# Altium schematic sheet gwcard.SchDoc
size A0
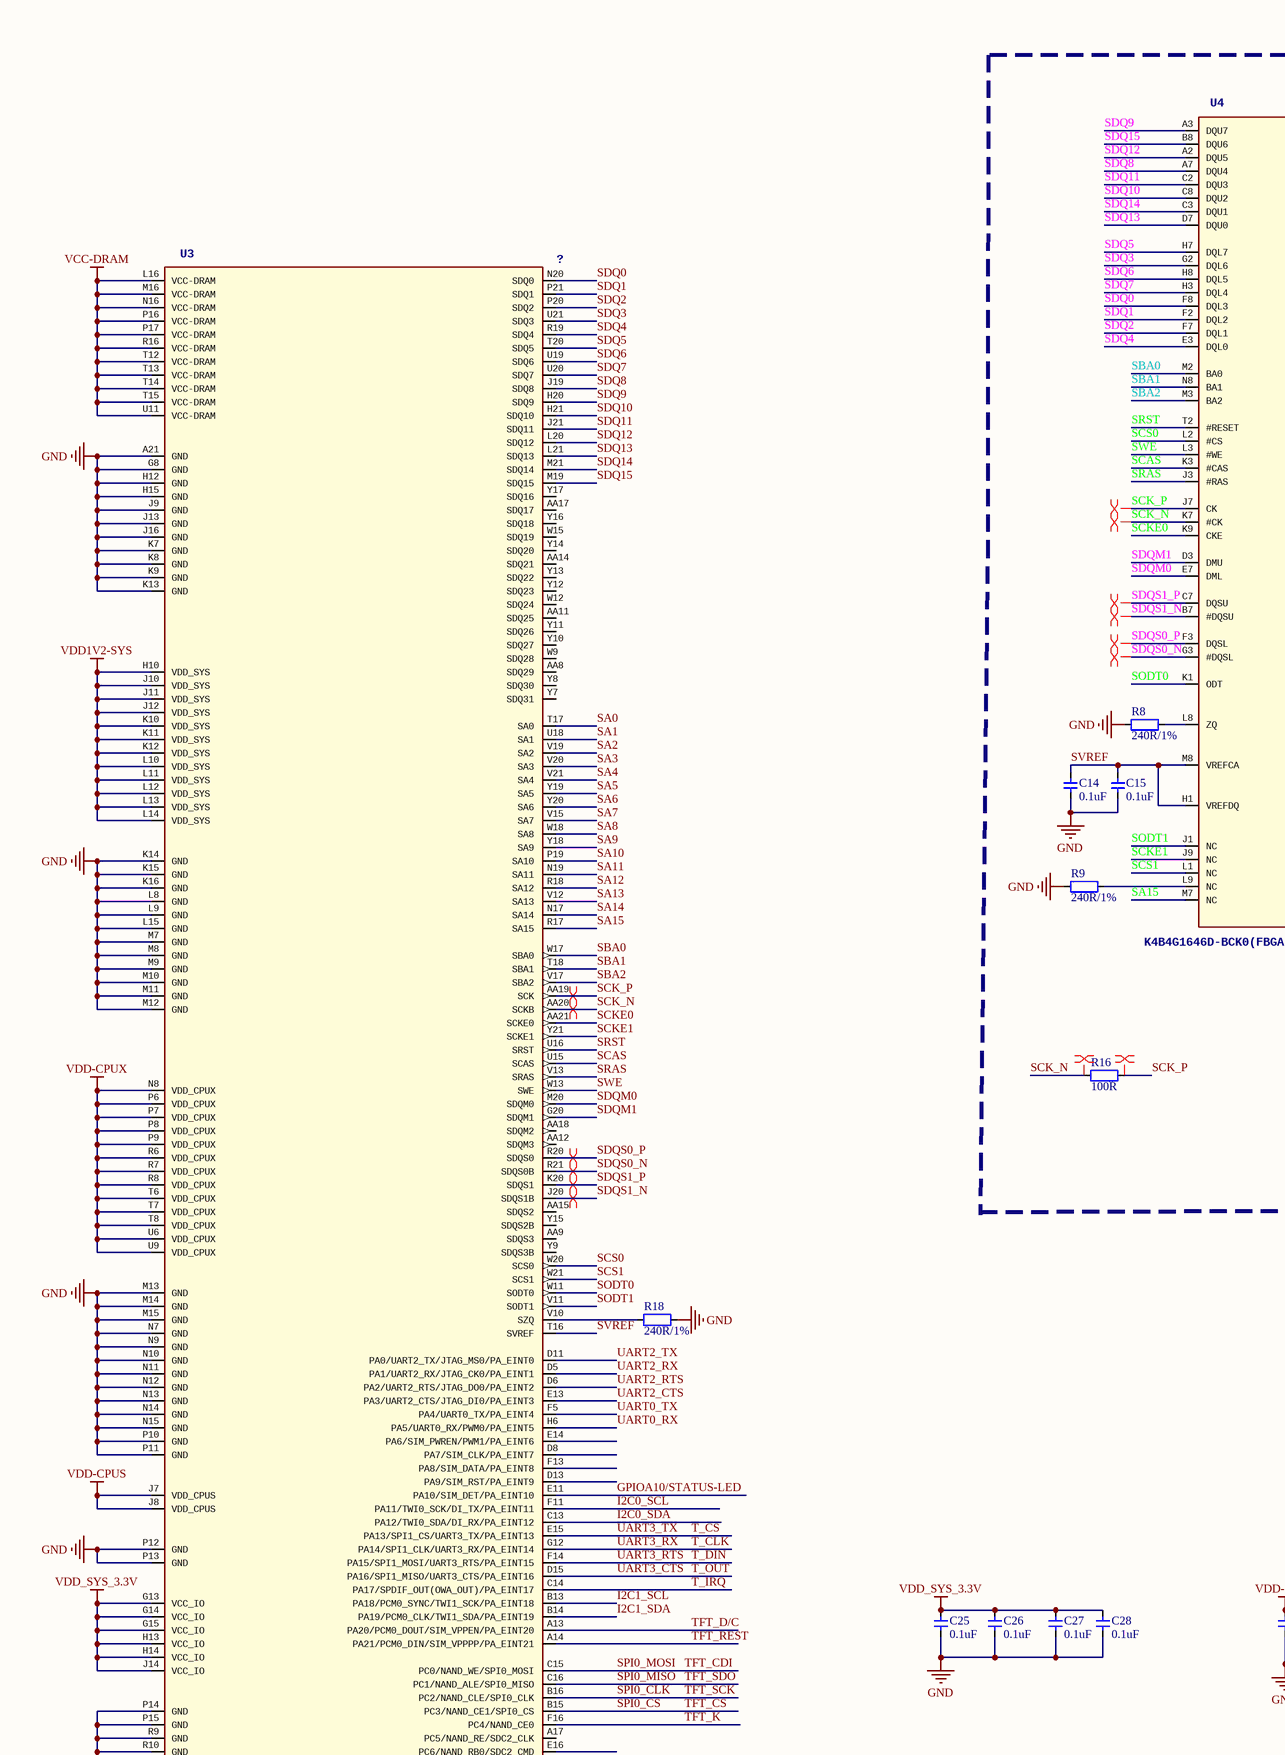
[diagram p0: gwcard.SchDoc, top left]
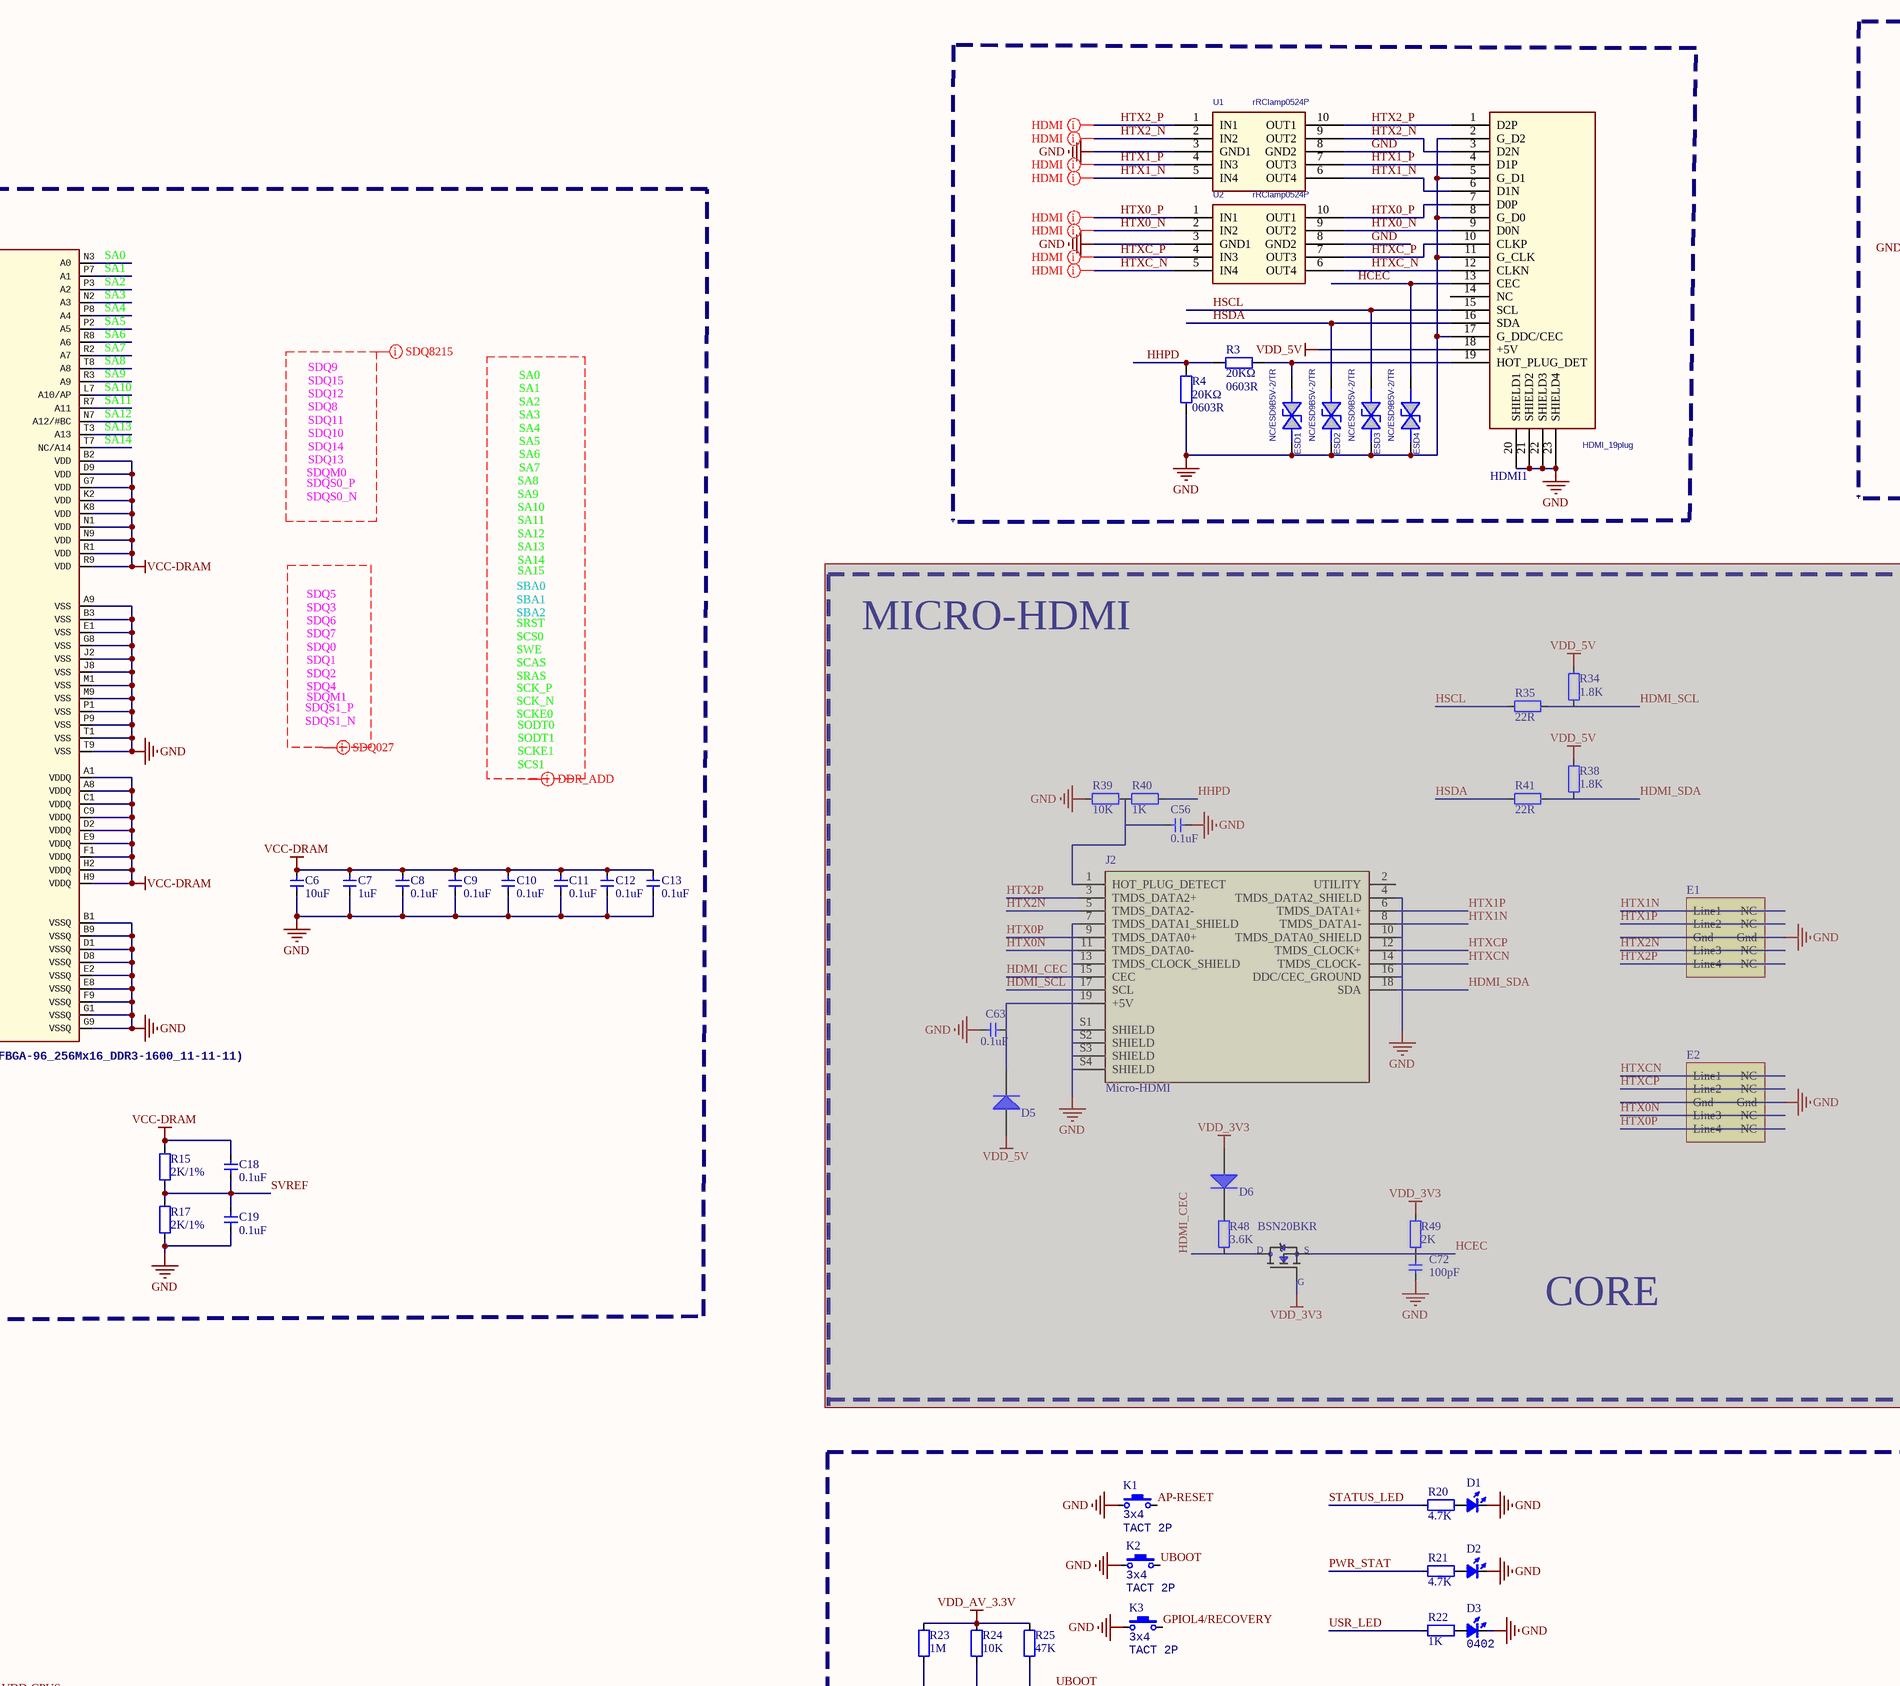
[diagram p1: gwcard.SchDoc, top middle]
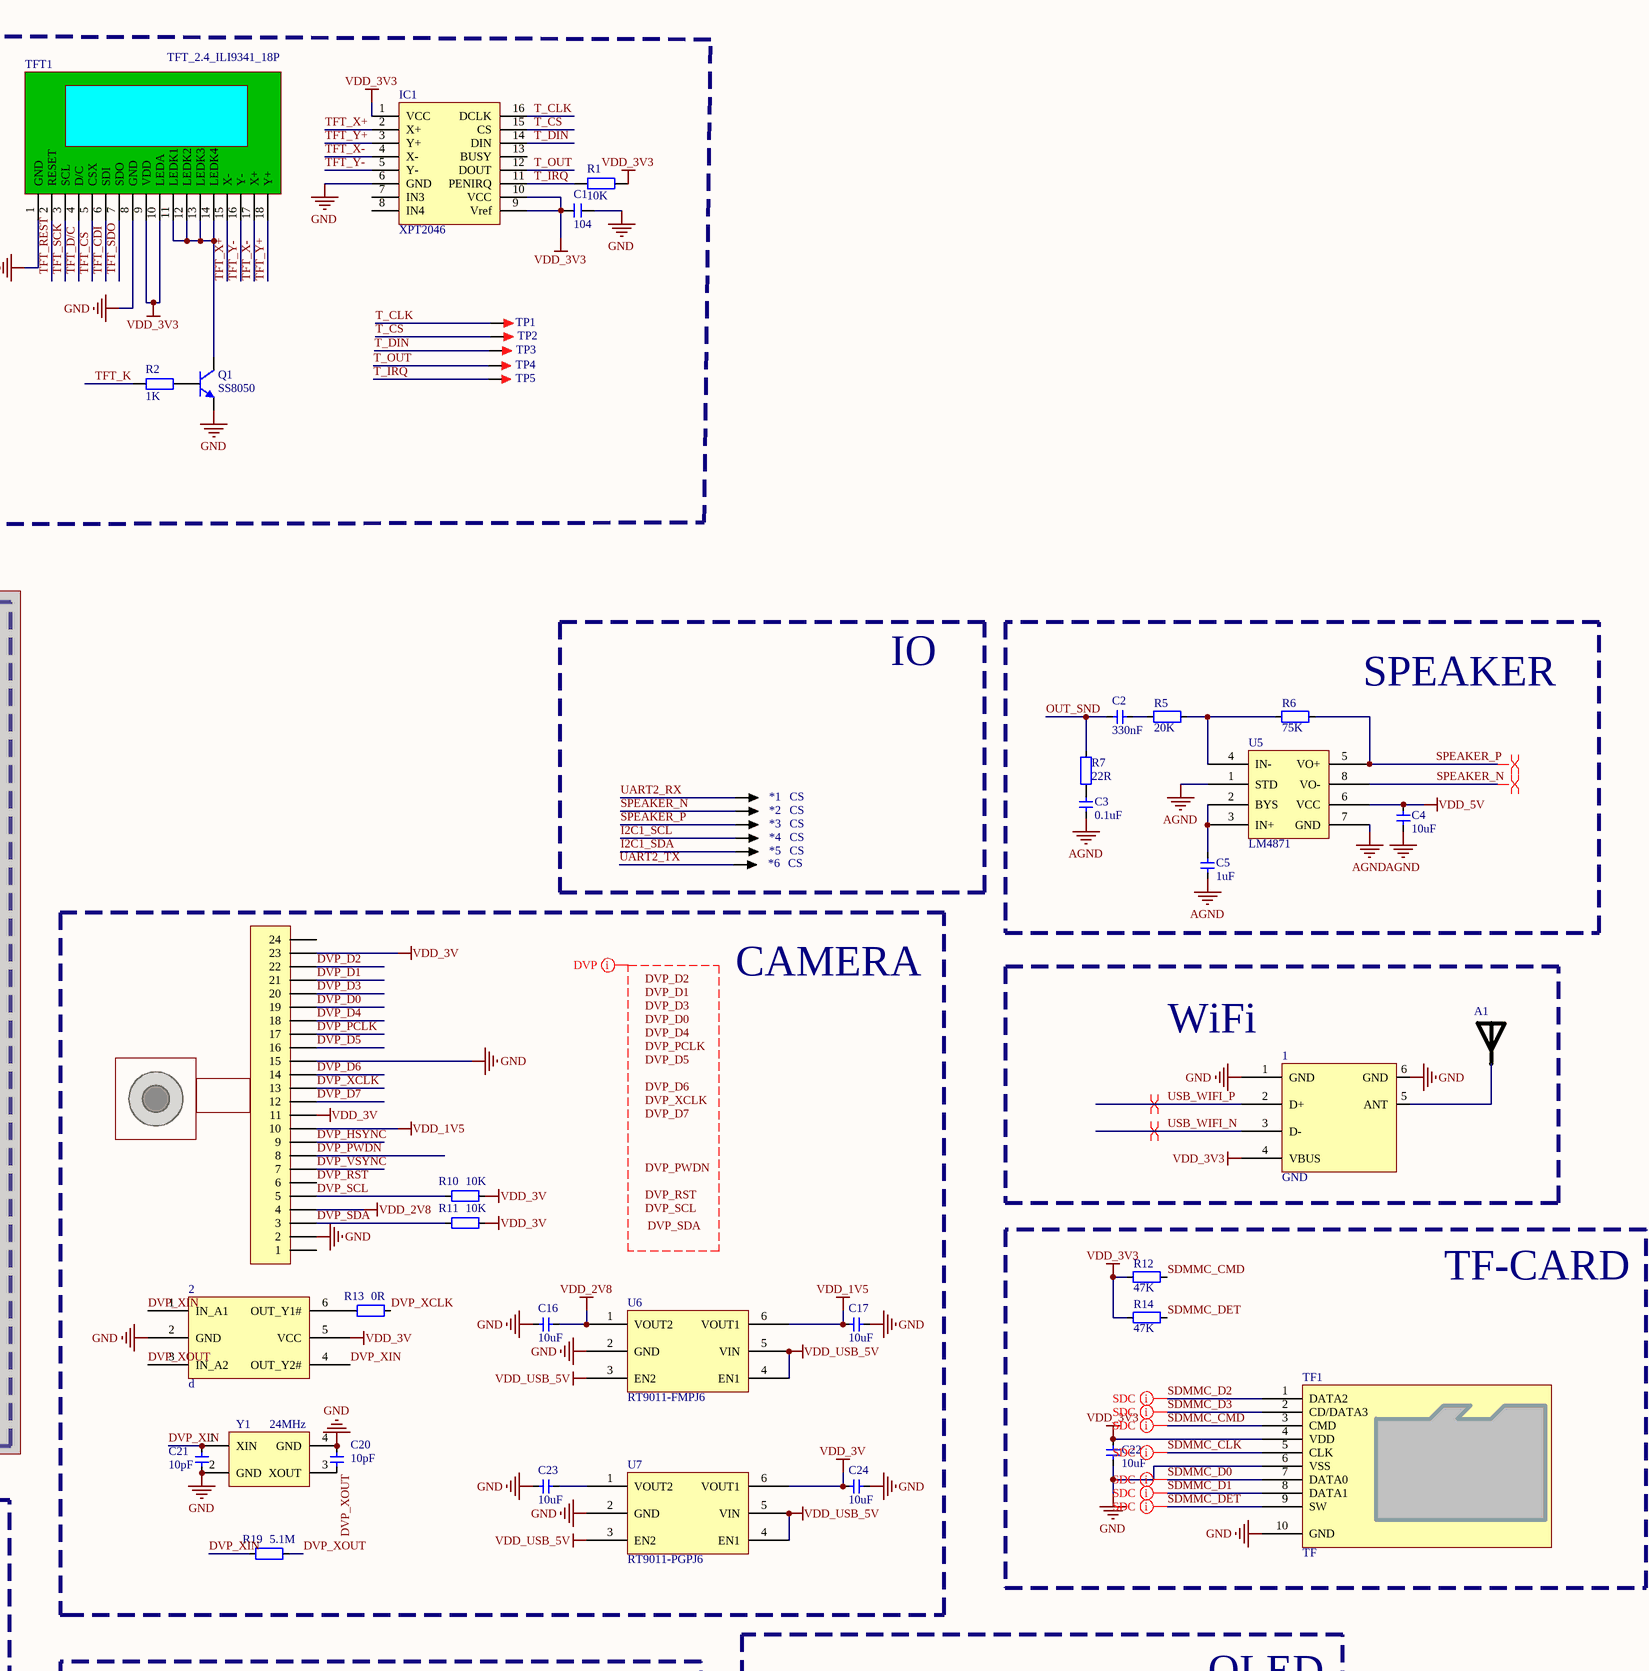
[diagram p2: gwcard.SchDoc, top right]
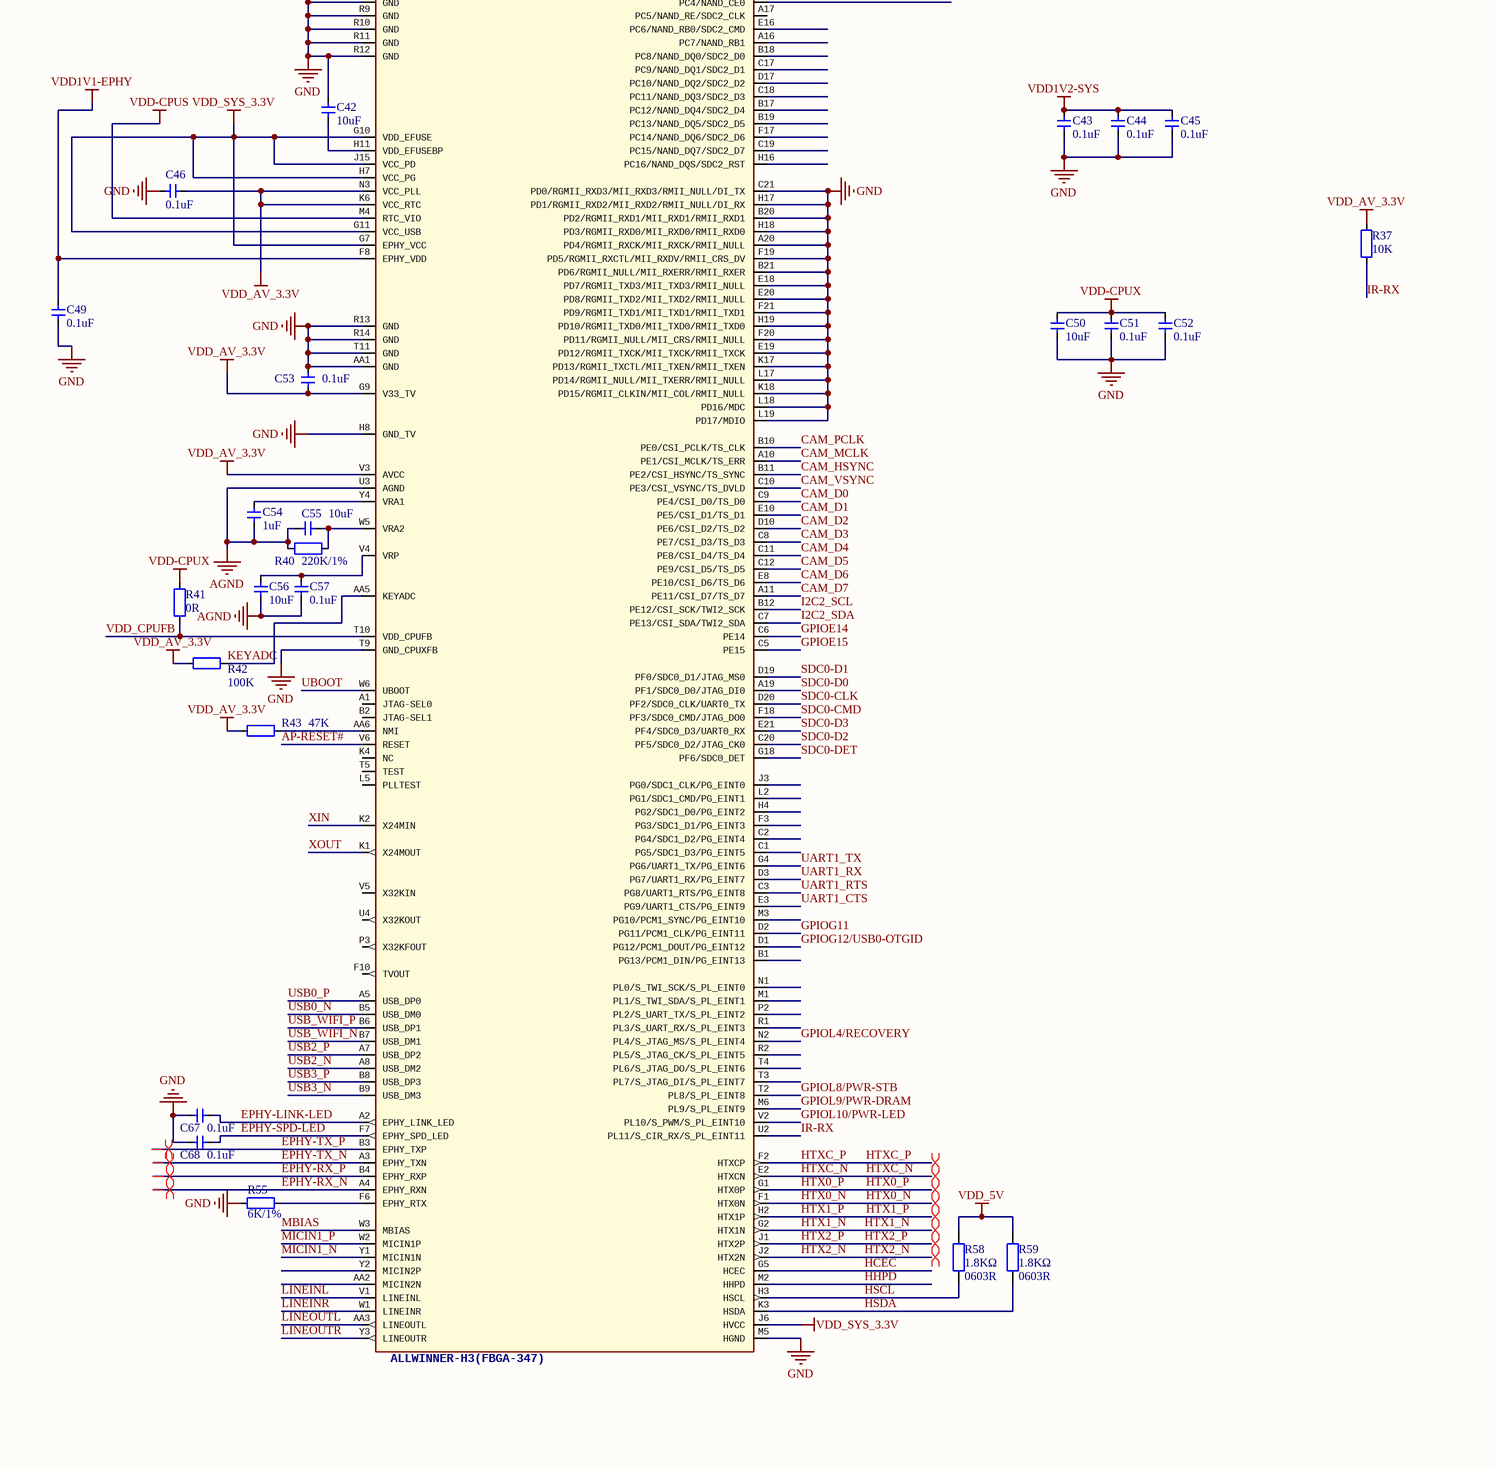
[diagram p3: gwcard.SchDoc, bottom left]
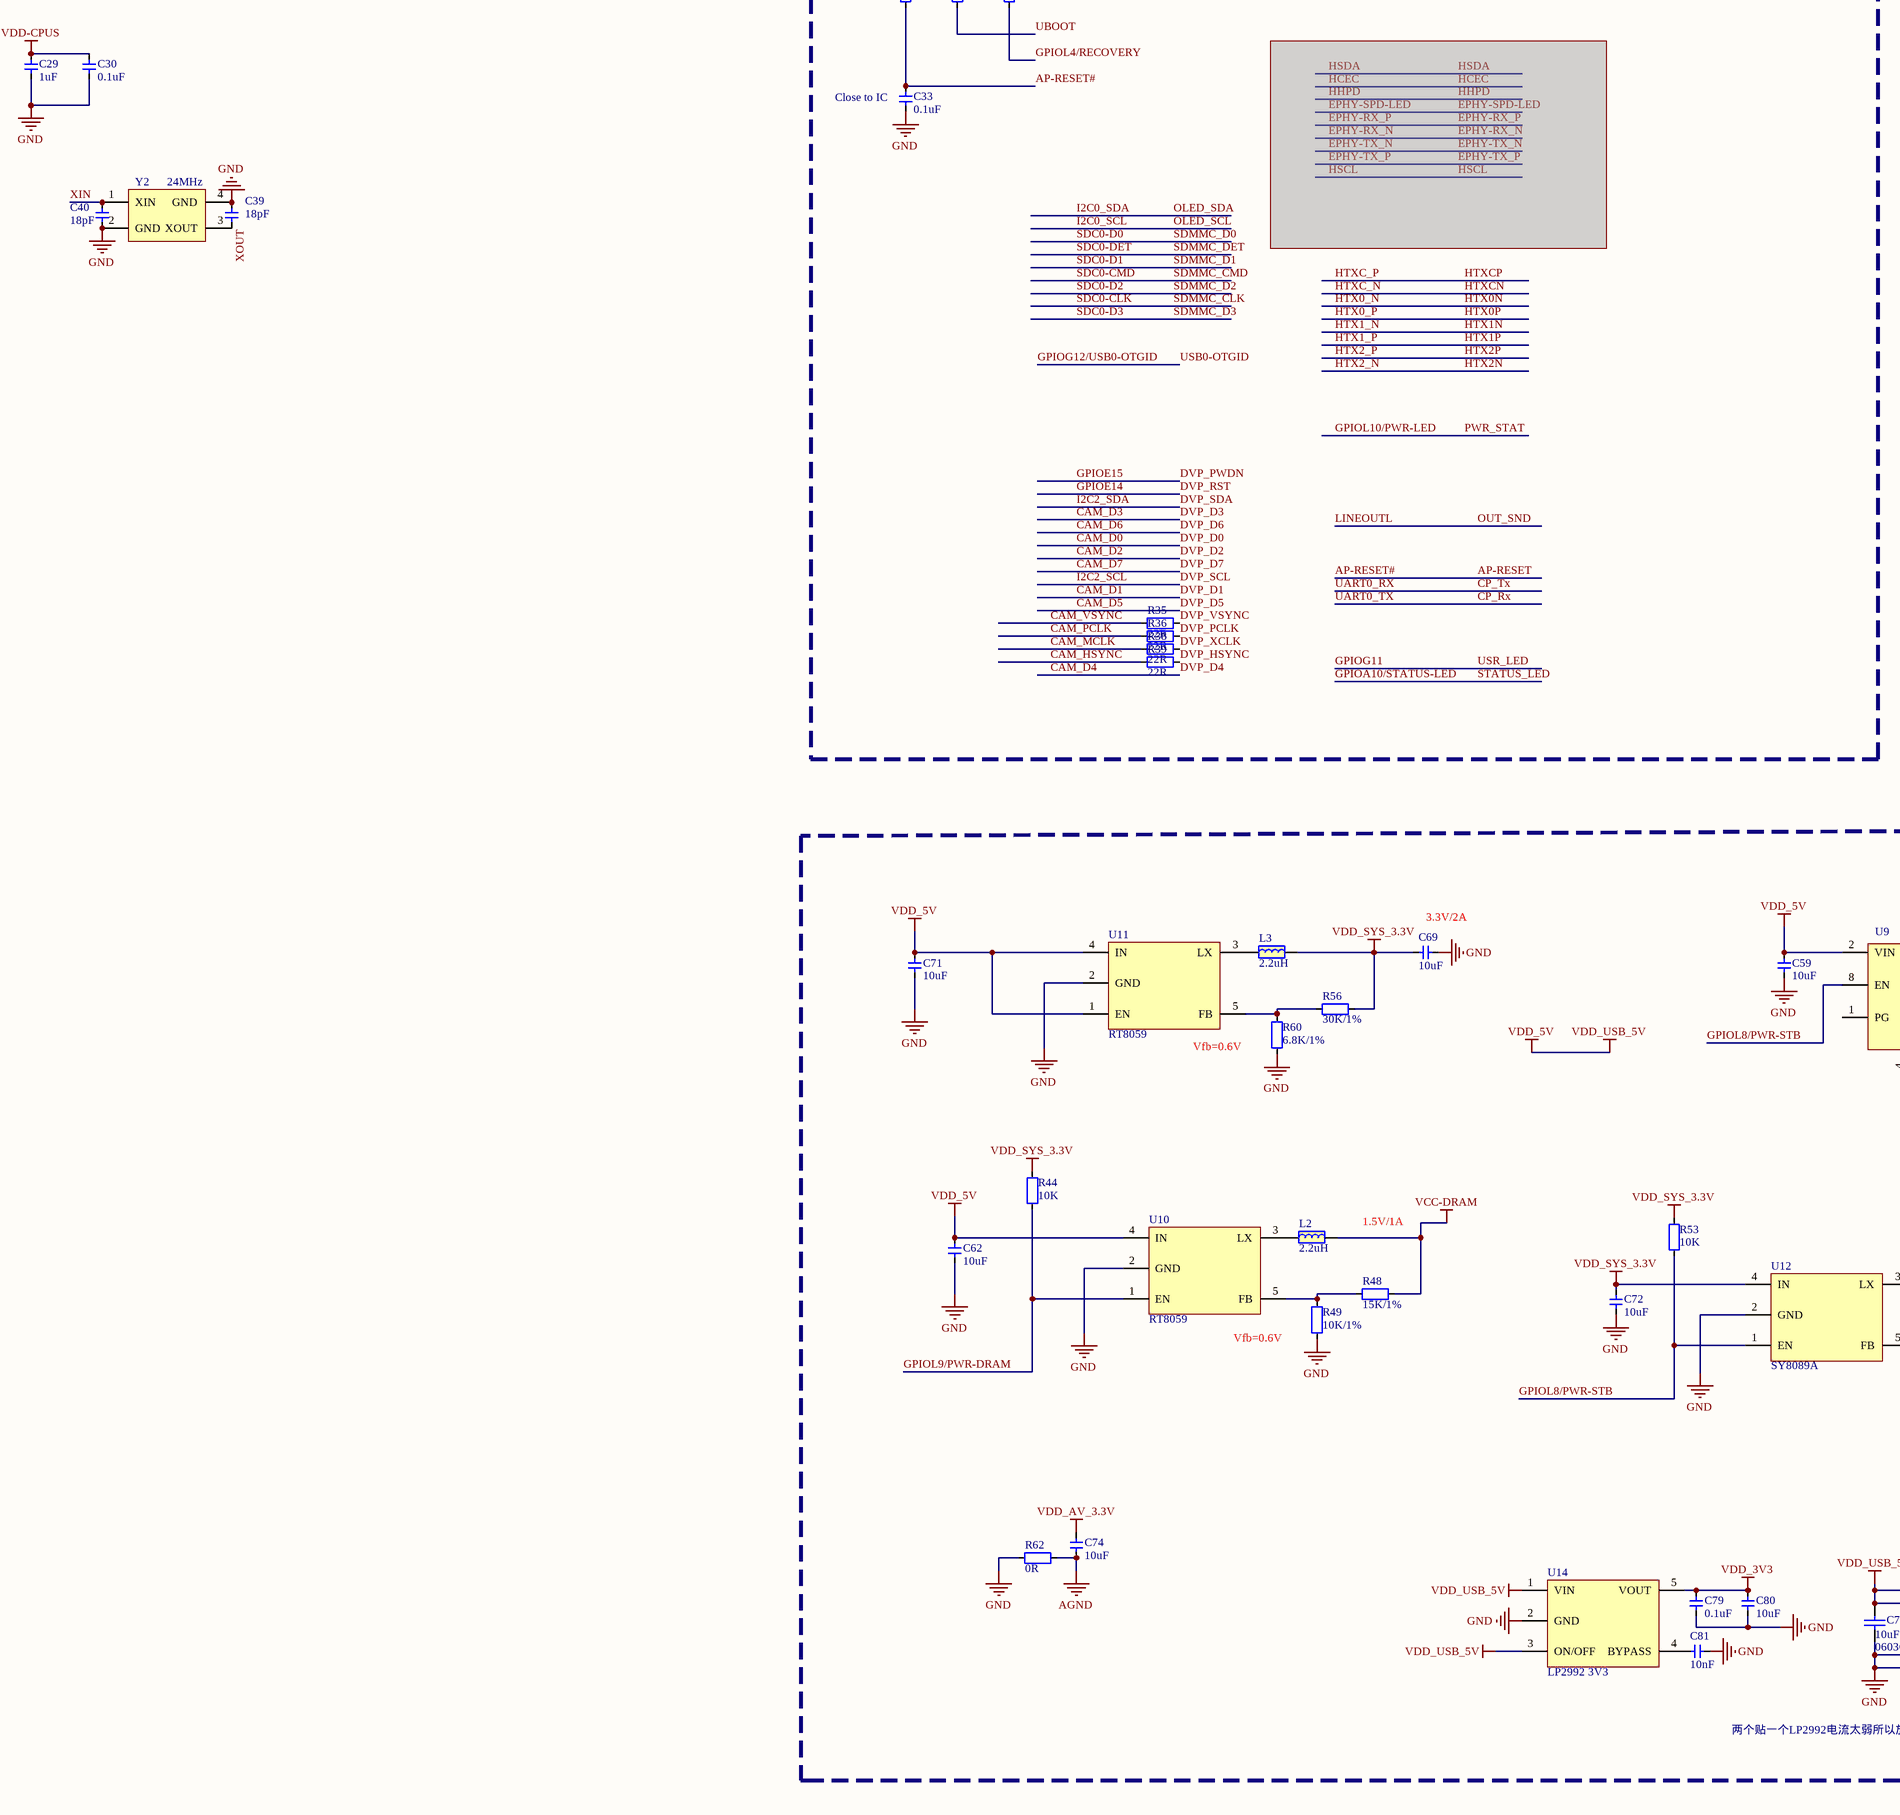
[diagram p4: gwcard.SchDoc, bottom middle]
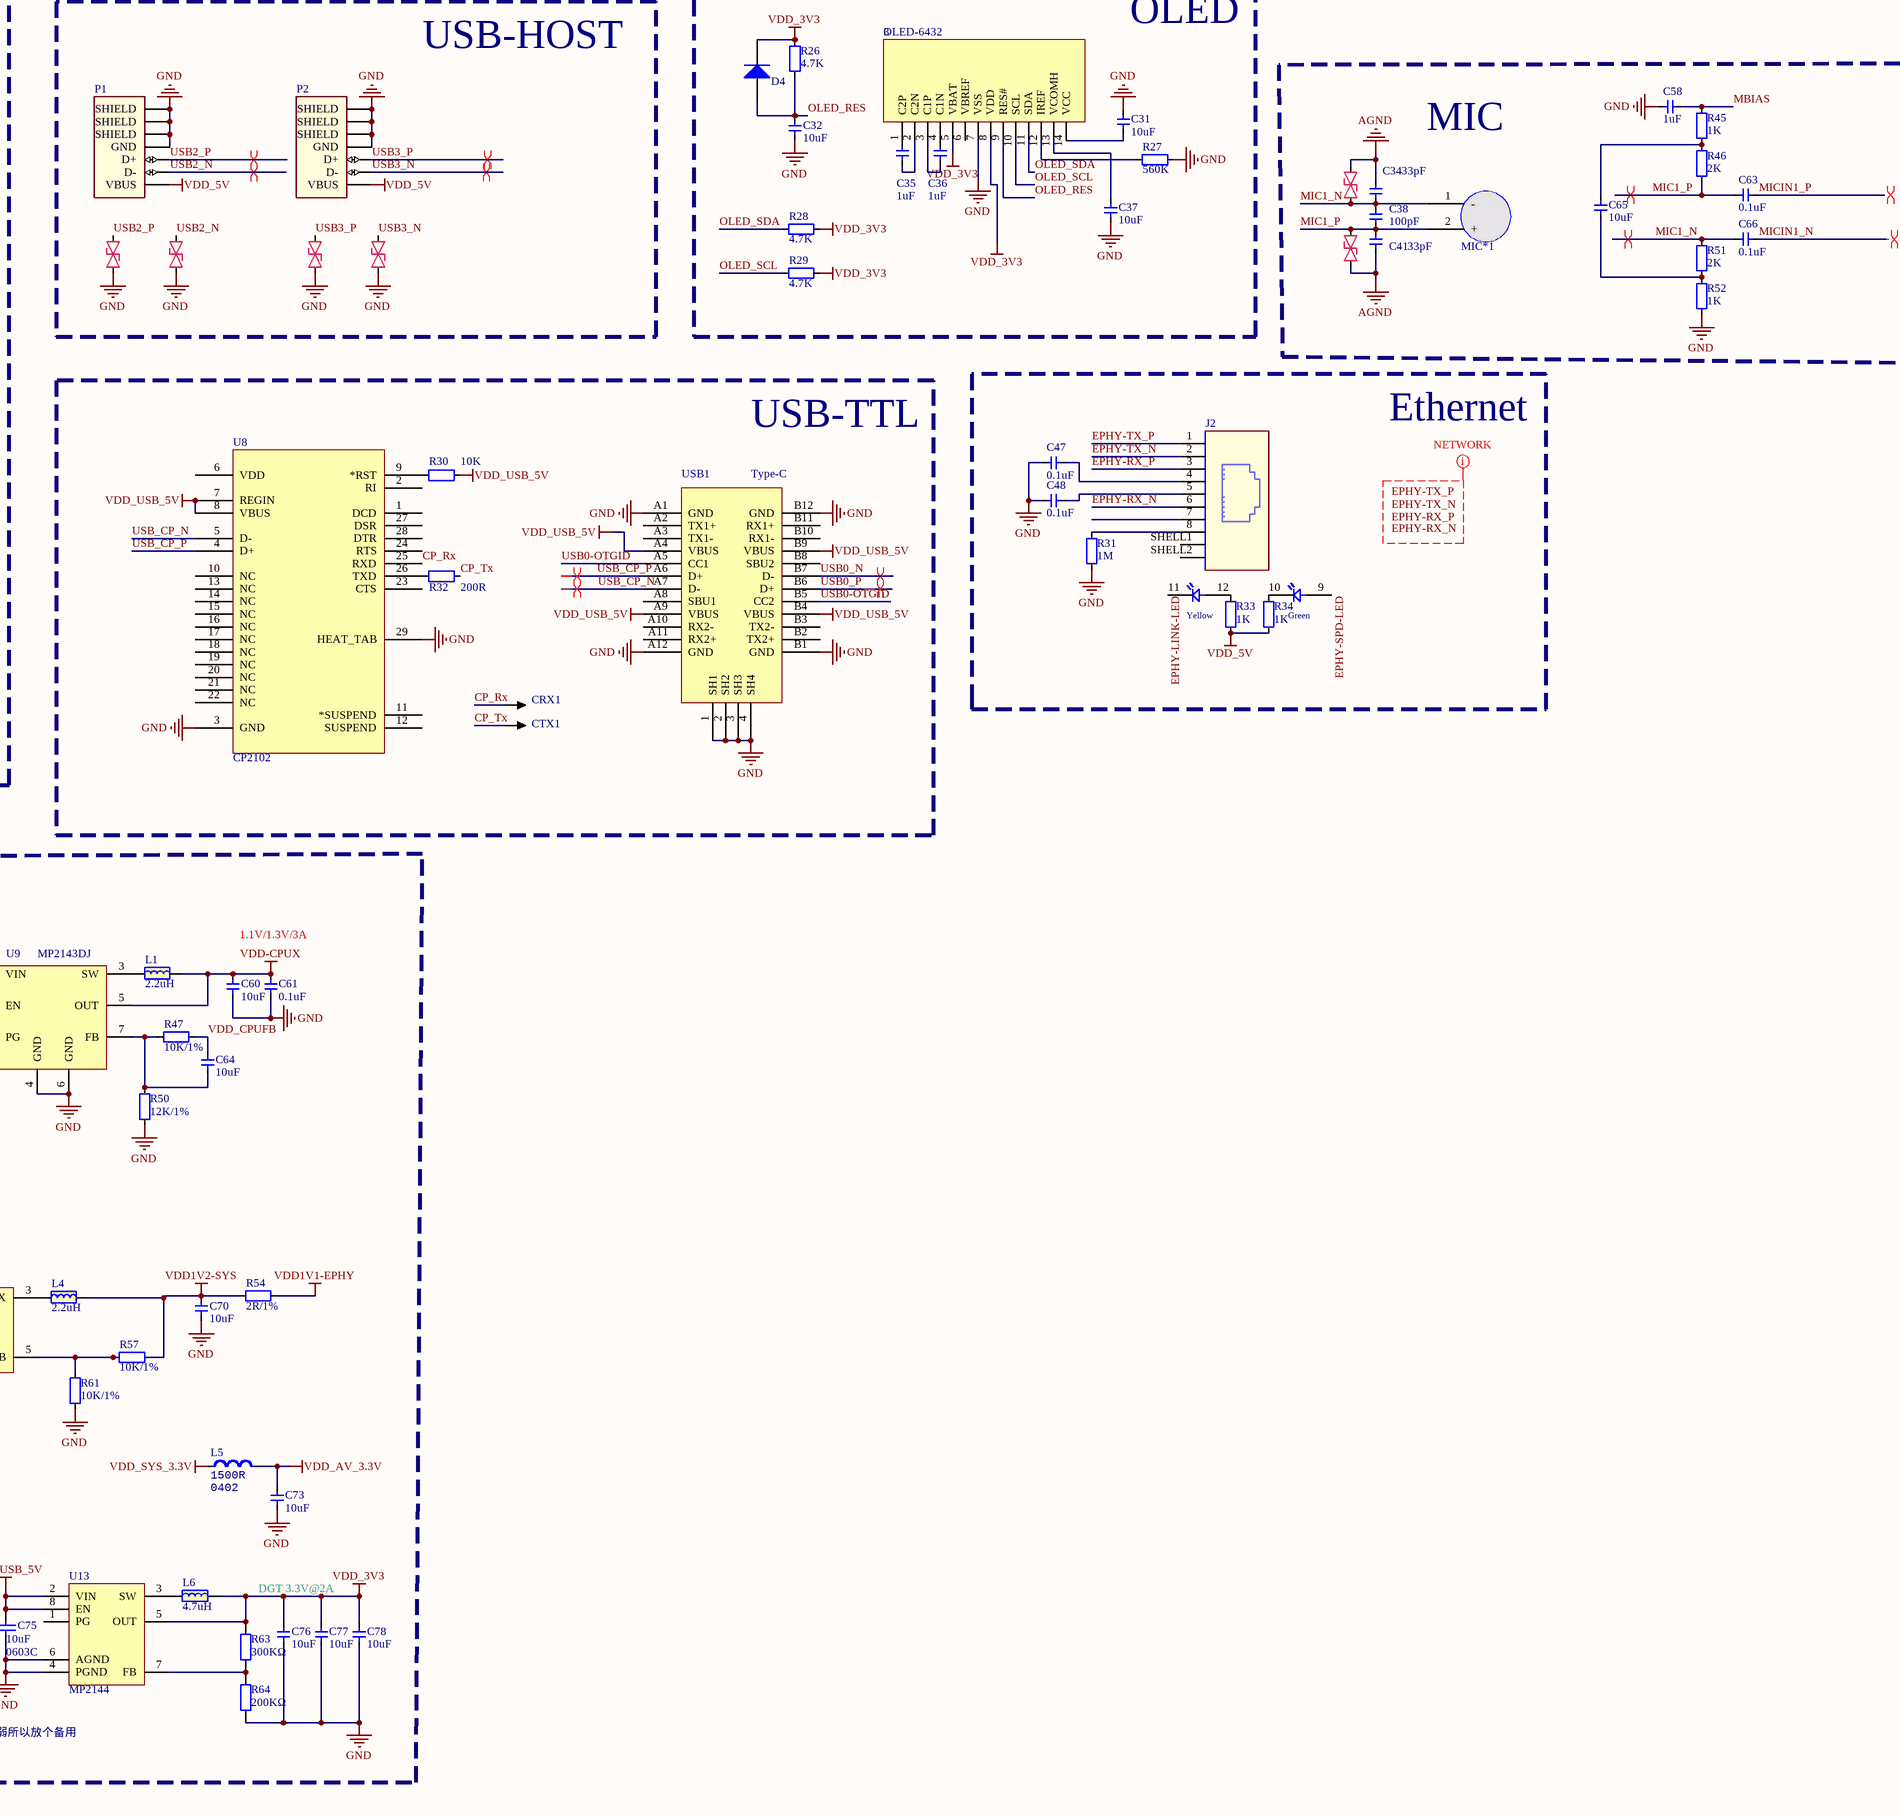
[diagram p5: gwcard.SchDoc, bottom right]

## Parts
(Parts that share a designator on the sheet are numbered #1, #2 ... from top to bottom, then left to right.)
1  GND  [USB-WIFI-ANT]
2  d  [SOT363-6]
3  OLED-6432  [OLED-6432-TOP]
4  BSN20BKR  [SOT23-3]  (masked out: inside a compile mask, not in the netlist)
*1  CS  [TEST 1.6]
*2  CS  [TEST 1.6]
*3  CS  [TEST 1.6]
*4  CS  [TEST 1.6]
*5  CS  [TEST 1.6]
*6  CS  [TEST 1.6]
A1  RAINSUN  [ANT-RAINSUN-AN5120]  (value not drawn)
C1  104  [CAP_0402]
C2  330nF  [CAP_0402]
C3  0.1uF  [CAP_0402]
C4  10uF  [CAP_0402]
C5  1uF  [CAP_0402]
C6  10uF  [CAP_0402]
C7  1uF  [CAP_0402]
C8  0.1uF  [CAP_0402]
C9  0.1uF  [CAP_0402]
C10  0.1uF  [CAP_0402]
C11  0.1uF  [CAP_0402]
C12  0.1uF  [CAP_0402]
C13  0.1uF  [CAP_0402]
C14  0.1uF  [CAP_0402]
C15  0.1uF  [CAP_0402]
C16  10uF  [CAP_0402]
C17  10uF  [CAP_0402]
C18  0.1uF  [CAP_0402]
C19  0.1uF  [CAP_0402]
C20  10pF  [CAP_0402]
C21  10pF  [CAP_0402]
C22  10uF  [CAP_0402]
C23  10uF  [CAP_0402]
C24  10uF  [CAP_0402]
C25  0.1uF  [CAP_0402]
C26  0.1uF  [CAP_0402]
C27  0.1uF  [CAP_0402]
C28  0.1uF  [CAP_0402]
C29  1uF  [CAP_0402]
C30  0.1uF  [CAP_0402]
C31  10uF  [CAP_0402]
C32  10uF  [CAP_0402]
C33  0.1uF  [CAP_0402]
C34  33pF  [CAP_0402]
C35  1uF  [CAP_0402]
C36  1uF  [CAP_0402]
C37  10uF  [CAP_0402]
C38  100pF  [CAP_0402]
C39  18pF  [CAP_0402]
C40  18pF  [CAP_0402]
C41  33pF  [CAP_0402]
C42  10uF  [CAP_0402]
C43  0.1uF  [CAP_0402]
C44  0.1uF  [CAP_0402]
C45  0.1uF  [CAP_0402]
C46  0.1uF  [CAP_0402]
C47  0.1uF  [CAP_0402]
C48  0.1uF  [CAP_0402]
C49  0.1uF  [CAP_0402]
C50  10uF  [CAP_0402]
C51  0.1uF  [CAP_0402]
C52  0.1uF  [CAP_0402]
C53  0.1uF  [CAP_0402]
C54  1uF  [CAP_0402]
C55  10uF  [CAP_0402]
C56#1  0.1uF  [CAP_0402]  (masked out: inside a compile mask, not in the netlist)
C56#2  10uF  [CAP_0402]
C57  0.1uF  [CAP_0402]
C58  1uF  [CAP_0402]
C59  10uF  [CAP_0402]
C60  10uF  [CAP_0402]
C61  0.1uF  [CAP_0402]
C62  10uF  [CAP_0402]
C63#1  0.1uF  [CAP_0402]  (masked out: inside a compile mask, not in the netlist)
C63#2  0.1uF  [CAP_0402]
C64  10uF  [CAP_0402]
C65  10uF  [CAP_0402]
C66  0.1uF  [CAP_0402]
C67  0.1uF  [CAP_0402]
C68  0.1uF  [CAP_0402]
C69  10uF  [CAP_0402]
C70  10uF  [CAP_0402]
C71  10uF  [CAP_0402]
C72#1  100pF  [CAP_0402]  (masked out: inside a compile mask, not in the netlist)
C72#2  10uF  [CAP_0402]
C73  10uF  [CAP_0402]
C74  10uF  [CAP_0402]
C75  10uF  Package: 0603C  [CAP_0402]
C76  10uF  [CAP_0402]
C77  10uF  [CAP_0402]
C78  10uF  [CAP_0402]
C79  0.1uF  [CAP_0402]
C80  10uF  [CAP_0402]
C81  10nF  [CAP_0402]
CRX1  CS  [TEST 1.6]  (value not drawn)
CTX1  CS  [TEST 1.6]  (value not drawn)
D1  color?  [LED_0402_RED]  (value not drawn)
D2  color?  [LED_0402_RED]  (value not drawn)
D3  Type: 0402  [LED_0402_RED]  (hidden comment: color?)
D4  二极管-5B5817WS  [SOD-323]  (value not drawn)
D5  二极管-5B5817WS  [SOD-323]  (value not drawn)  (masked out: inside a compile mask, not in the netlist)
D6  二极管-5B5817WS  [SOD-323]  (value not drawn)  (masked out: inside a compile mask, not in the netlist)
E1  E?  [DFN-2510]  (value not drawn)  (masked out: inside a compile mask, not in the netlist)
E2  E?  [DFN-2510]  (value not drawn)  (masked out: inside a compile mask, not in the netlist)
ESD1  NC/ESD9B5V-2/TR  [tvs0402]
ESD2  NC/ESD9B5V-2/TR  [tvs0402]
ESD3  NC/ESD9B5V-2/TR  [tvs0402]
ESD4  NC/ESD9B5V-2/TR  [tvs0402]
ESD-1  ESD-0402  [ESD-0402]  (value not drawn)
ESD-2  ESD-0402  [ESD-0402]  (value not drawn)
ESD-3  ESD-0402  [ESD-0402]  (value not drawn)
ESD-4  ESD-0402  [ESD-0402]  (value not drawn)
ESD-5  ESD-0402  [ESD-0402]  (value not drawn)
ESD-6  ESD-0402  [ESD-0402]  (value not drawn)
HDMI1  HDMI_19plug  [HDMI_SMD_A]
IC1  XPT2046  [QFN16 4x4_N]
J1  0.5S_A_24PWB  [FPC-24P]  (value not drawn)
J2#1  Micro-HDMI  [MICRO HDMI]  (masked out: inside a compile mask, not in the netlist)
J2#2  RJ45座  [RJ45母座]  (value not drawn)
K1  value 3x4  [ButtonTACT_3x4x2_180]  (hidden comment: TACT 2P)
K2  value 3x4  [ButtonTACT_3x4x2_180]  (hidden comment: TACT 2P)
K3  value 3x4  [ButtonTACT_3x4x2_180]  (hidden comment: TACT 2P)
L1  2.2uH  [2520-L]
L2  2.2uH  [2520-L]
L3  2.2uH  [2520-L]
L4  2.2uH  [2520-L]
L5  value 1500R  Type: 0402  [IND_0402]  (hidden comment: H0402)
L6  4.7uH  [2520-L]
MIC*1  MIC*  [MIC-0416]  (value not drawn)
P1  USB-侧立式  [USB-侧立式]  (value not drawn)
P2  USB-侧立式  [USB-侧立式]  (value not drawn)
Q1  SS8050  [SOT23-3N]
R1  10K  [R 0402_M]
R2  1K  [R 0402_M]
R3  20KΩ  Package: 0603R  [RES_0402]
R4  20KΩ  Package: 0603R  [RES_0402]
R5  20K  [RES_0402]
R6  75K  [RES_0402]
R7  22R  [RES_0402]
R8  240R/1%  [RES_0402]
R9  240R/1%  [RES_0402]
R10  10K  [RES_0402]
R11  10K  [RES_0402]
R12  47K  [RES_0402]
R13  0R  [RES_0402]
R14  47K  [RES_0402]
R15  2K/1%  [RES_0402]
R16  100R  [RES_0402]
R17  2K/1%  [RES_0402]
R18  240R/1%  [RES_0402]
R19  5.1M  [RES_0402]
R20  4.7K  [RES_0402]
R21  4.7K  [RES_0402]
R22  1K  [RES_0402]
R23  1M  [RES_0402]
R24  10K  [RES_0402]
R25  47K  [RES_0402]
R26  4.7K  [RES_0402]
R27  560K  [RES_0402]
R28  4.7K  [RES_0402]
R29  4.7K  [RES_0402]
R30  10K  [RES_0402]
R31  1M  [RES_0402]
R32  200R  [RES_0402]
R33  1K  [RES_0402]
R34#1  1.8K  [RES_0402]  (masked out: inside a compile mask, not in the netlist)
R34#2  1K  [RES_0402]
R35#1  22R  [RES_0402]  (masked out: inside a compile mask, not in the netlist)
R35#2  22R  [RES_0402]
R36  22R  [RES_0402]
R37  10K  [RES_0402]
R38#1  1.8K  [RES_0402]  (masked out: inside a compile mask, not in the netlist)
R38#2  22R  [RES_0402]
R39#1  10K  [RES_0402]  (masked out: inside a compile mask, not in the netlist)
R39#2  22R  [RES_0402]
R40#1  1K  [RES_0402]  (masked out: inside a compile mask, not in the netlist)
R40#2  220K/1%  [RES_0402]
R41#1  22R  [RES_0402]  (masked out: inside a compile mask, not in the netlist)
R41#2  0R  [RES_0402]
R42  100K  [RES_0402]
R43  47K  [RES_0402]
R44  10K  [RES_0402]
R45  1K  [RES_0402]
R46  2K  [RES_0402]
R47  10K/1%  [RES_0402]
R48#1  3.6K  [RES_0402]  (masked out: inside a compile mask, not in the netlist)
R48#2  15K/1%  [RES_0402]
R49#1  2K  [RES_0402]  (masked out: inside a compile mask, not in the netlist)
R49#2  10K/1%  [RES_0402]
R50  12K/1%  [RES_0402]
R51  2K  [RES_0402]
R52  1K  [RES_0402]
R53  10K  [RES_0402]
R54  2R/1%  [RES_0402]
R55  6K/1%  [RES_0402]
R56  30K/1%  [RES_0402]
R57  10K/1%  [RES_0402]
R58  1.8KΩ  Package: 0603R  [RES_0402]
R59  1.8KΩ  Package: 0603R  [RES_0402]
R60  6.8K/1%  [RES_0402]
R61  10K/1%  [RES_0402]
R62  0R  [RES_0402]
R63  300KΩ  [RES_0402]
R64  200KΩ  [RES_0402]
TF1  TF  [TF-SOCKET - SHORT]
TFT1  TFT_2.4_ILI9341_18P  [FPC0.5 2H-WS-18P]
TP1  TEST  [TEST 1]  (value not drawn)
TP2  TEST  [TEST 1]  (value not drawn)
TP3  TEST  [TEST 1]  (value not drawn)
TP4  TEST  [TEST 1]  (value not drawn)
TP5  TEST  [TEST 1]  (value not drawn)
U1  rRClamp0524P  [RCLAMP0524P]
U2  rRClamp0524P  [RCLAMP0524P]
U3  ALLWINNER-H3(FBGA-347)  [FBGA-347 - duplicate]
U4  K4B4G1646D-BCK0(FBGA-96_256Mx16_DDR3-1600_11-11-11)  [FBGA96(HYNIX_SAMSUNG_512MX16_DDR3)]
U5  LM4871  [MSOP-8]
U6  RT9011-FMPJ6  [SOT23-6]
U7  RT9011-PGPJ6  [SOT23-6]
U8  CP2102  [QFN-28]
U9  MP2143DJ  [SOT23-8]
U10  RT8059  [SOT23-5]
U11  RT8059  [SOT23-5]
U12  SY8089A  [SOT23-5]
U13  MP2144  [SOT23-8]
U14  LP2992 3V3  [SOT23-5]
USB1  Type-C  [TYPE-C-TOP]
Y1  24MHz  [晶振2520]
Y2  24MHz  [晶振2520]

## Blocks framed on the sheet
IO: *1-*6
SPEAKER: C2-C5 R5-R7 U5
TF-CARD: C22 R12 R14 TF1
USB-HOST: ESD-3-ESD-6 P1 P2

## Nets
AGND: C3.1 C4.1 C5.1 C34.1 C41.1 C54.2 C55.1 C56#2.1 C57.1 C74.1 ESD-1.2 ESD-2.1 R40#2.1 R62.1 U3.U3(AGND) U5.1(STD) U5.7(GND)
GND: 1.1(GND) 1.6(GND) 2.2(GND) 3.7(VSS) C1.2 C6.1 C7.1 C8.1 C9.1 C10.1 C11.1 C12.1 C13.1 C14.1 C15.1 C16.1 C17.1 C19.1 C20.2 C21.1 C22.1 C23.1 C24.1 C25.1 C26.1 C27.1 C28.1 C29.1 C30.1 C31.1 C32.1 C33.1 C37.2 C39.2 C40.1 C42.2 C43.1 C44.1 C45.1 C46.2 C47.2 C48.2 C49.1 C50.1 C51.1 C52.1 C53.1 C58.2 C59.1 C60.1 C61.1 C62.1 C67.1 C68.1 C69.1 C70.1 C71.1 C72#2.1 C73.1 C75.1 C76.1 C77.1 C78.1 C79.1 C80.1 C81.1 D1.2(K) D2.2(K) D3.2(K) ESD1.2(CATHODE) ESD2.2(CATHODE) ESD3.2(CATHODE) ESD4.2(CATHODE) ESD-3.1 ESD-4.1 ESD-5.1 ESD-6.1 HDMI1.2(G_D2) HDMI1.5(G_D1) HDMI1.8(G_D0) HDMI1.11(G_CLK) HDMI1.17(G_DDC/CEC) HDMI1.20(SHIELD1) HDMI1.21(SHIELD2) HDMI1.22(SHIELD3) HDMI1.23(SHIELD4) IC1.6(GND) J1.2 J1.15 K1.1 K2.1 K3.1 P1.4(GND) P1.5(SHIELD) P1.6(SHIELD) P1.7(SHIELD) P2.4(GND) P2.5(SHIELD) P2.6(SHIELD) P2.7(SHIELD) Q1.2(E) R4.1 R8.2 R9.2 R17.1 R18.2 R27.1 R31.1 R49#2.1 R50.1 R52.1 R55.1 R60.1 R61.1 R62.2 R64.2 TF1.6(VSS) TF1.10(GND) TFT1.1(GND) TFT1.8(GND) U1.3(GND1) U1.8(GND2) U2.3(GND1) U2.8(GND2) U3.A20(PD4/RGMII_RXCK/MII_RXCK/RMII_NULL) U3.A21(GND) U3.AA1(GND) U3.B20(PD2/RGMII_RXD1/MII_RXD1/RMII_RXD1) U3.B21(PD6/RGMII_NULL/MII_RXERR/RMII_RXER) U3.C21(PD0/RGMII_RXD3/MII_RXD3/RMII_NULL/DI_TX) U3.E18(PD7/RGMII_TXD3/MII_TXD3/RMII_NULL) U3.E19(PD12/RGMII_TXCK/MII_TXCK/RMII_TXCK) U3.E20(PD8/RGMII_TXD2/MII_TXD2/RMII_NULL) U3.F19(PD5/RGMII_RXCTL/MII_RXDV/RMII_CRS_DV) U3.F20(PD11/RGMII_NULL/MII_CRS/RMII_NULL) U3.F21(PD9/RGMII_TXD1/MII_TXD1/RMII_TXD1) U3.G8(GND) U3.H8(GND_TV) U3.H12(GND) U3.H15(GND) U3.H17(PD1/RGMII_RXD2/MII_RXD2/RMII_NULL/DI_RX) U3.H18(PD3/RGMII_RXD0/MII_RXD0/RMII_RXD0) U3.H19(PD10/RGMII_TXD0/MII_TXD0/RMII_TXD0) U3.J9(GND) U3.J13(GND) U3.J16(GND) U3.K7(GND) U3.K8(GND) U3.K9(GND) U3.K13(GND) U3.K14(GND) U3.K15(GND) U3.K16(GND) U3.K17(PD13/RGMII_TXCTL/MII_TXEN/RMII_TXEN) U3.K18(PD15/RGMII_CLKIN/MII_COL/RMII_NULL) U3.L8(GND) U3.L9(GND) U3.L15(GND) U3.L17(PD14/RGMII_NULL/MII_TXERR/RMII_NULL) U3.L18(PD16/MDC) U3.L19(PD17/MDIO) U3.M5(HGND) U3.M7(GND) U3.M8(GND) U3.M9(GND) U3.M10(GND) U3.M11(GND) U3.M12(GND) U3.M13(GND) U3.M14(GND) U3.M15(GND) U3.N7(GND) U3.N9(GND) U3.N10(GND) U3.N11(GND) U3.N12(GND) U3.N13(GND) U3.N14(GND) U3.N15(GND) U3.P10(GND) U3.P11(GND) U3.P12(GND) U3.P13(GND) U3.P14(GND) U3.P15(GND) U3.R9(GND) U3.R10(GND) U3.R11(GND) U3.R12(GND) U3.R13(GND) U3.R14(GND) U3.T9(GND_CPUXFB) U3.T11(GND) U4.A9(VSS) U4.B1(VSSQ) U4.B3(VSS) U4.B9(VSSQ) U4.D1(VSSQ) U4.D8(VSSQ) U4.E1(VSS) U4.E2(VSSQ) U4.E8(VSSQ) U4.F9(VSSQ) U4.G1(VSSQ) U4.G8(VSS) U4.G9(VSSQ) U4.J2(VSS) U4.J8(VSS) U4.M1(VSS) U4.M9(VSS) U4.P1(VSS) U4.P9(VSS) U4.T1(VSS) U4.T9(VSS) U6.2(GND) U7.2(GND) U8.3(GND) U8.29(HEAT_TAB) U9.4(GND) U9.6(GND) U10.2(GND) U11.2(GND) U12.2(GND) U13.4(PGND) U13.6(AGND) U14.2(GND) USB1.1(SH1) USB1.2(SH2) USB1.3(SH3) USB1.4(SH4) USB1.A1(GND) USB1.A12(GND) USB1.B1(GND) USB1.B12(GND) Y1.2(GND) Y1.4(GND) Y2.2(GND) Y2.4(GND)
VCC-DRAM: C6.2 C7.2 C8.2 C9.2 C10.2 C11.2 C12.2 C13.2 C18.2 L2.2 R15.2 R48#2.1 U3.L16(VCC-DRAM) U3.M16(VCC-DRAM) U3.N16(VCC-DRAM) U3.P16(VCC-DRAM) U3.P17(VCC-DRAM) U3.R16(VCC-DRAM) U3.T12(VCC-DRAM) U3.T13(VCC-DRAM) U3.T14(VCC-DRAM) U3.T15(VCC-DRAM) U3.U11(VCC-DRAM) U4.A1(VDDQ) U4.A8(VDDQ) U4.B2(VDD) U4.C1(VDDQ) U4.C9(VDDQ) U4.D2(VDDQ) U4.D9(VDD) U4.E9(VDDQ) U4.F1(VDDQ) U4.G7(VDD) U4.H2(VDDQ) U4.H9(VDDQ) U4.K2(VDD) U4.K8(VDD) U4.N1(VDD) U4.N9(VDD) U4.R1(VDD) U4.R9(VDD)
VDD1V1-EPHY: C49.2 R54.2 U3.F8(EPHY_VDD)
VDD1V2-SYS: C43.2 C44.2 C45.2 C70.2 L4.2 R54.1 R57.2 U3.H10(VDD_SYS) U3.J10(VDD_SYS) U3.J11(VDD_SYS) U3.J12(VDD_SYS) U3.K10(VDD_SYS) U3.K11(VDD_SYS) U3.K12(VDD_SYS) U3.L10(VDD_SYS) U3.L11(VDD_SYS) U3.L12(VDD_SYS) U3.L13(VDD_SYS) U3.L14(VDD_SYS)
VDD-CPUS: C29.2 C30.2 U3.J7(VDD_CPUS) U3.J8(VDD_CPUS) U3.M4(RTC_VIO)
VDD-CPUX: C50.2 C51.2 C52.2 C60.2 C61.2 L1.2 R41#2.2 U3.N8(VDD_CPUX) U3.P6(VDD_CPUX) U3.P7(VDD_CPUX) U3.P8(VDD_CPUX) U3.P9(VDD_CPUX) U3.R6(VDD_CPUX) U3.R7(VDD_CPUX) U3.R8(VDD_CPUX) U3.T6(VDD_CPUX) U3.T7(VDD_CPUX) U3.T8(VDD_CPUX) U3.U6(VDD_CPUX) U3.U9(VDD_CPUX) U9.5(OUT)
VDD_1V5: C17.2 J1.10 U6.6(VOUT1)
VDD_2V8: C16.2 J1.4 U6.1(VOUT2)
VDD_3V: 2.5(VCC) C24.2 J1.11 J1.23 R10.2 R11.2 U7.6(VOUT1)
VDD_3V3: 1.4(VBUS) 3.5(VBAT) 3.8(VDD) C1.1 C22.2 C76.2 C77.2 C78.2 C79.2 C80.2 D4.2(K) IC1.1(VCC) IC1.9(Vref) IC1.10(VCC) L6.2 R1.1 R12.1 R14.1 R26.1 R28.2 R29.2 R63.1 TF1.4(VDD) TFT1.9(VDD) TFT1.10(LEDA) U13.5(OUT) U14.5(VOUT)
VDD_5V: C4.2 C59.2 C62.2 C71.2 C75.2 HDMI1.18(+5V) P1.1(VBUS) P2.1(VBUS) R30.1 R33.1 R34#2.1 R58.1 R59.1 U5.6(VCC) U6.3(EN2) U6.4(EN1) U6.5(VIN) U7.3(EN2) U7.4(EN1) U7.5(VIN) U8.7(REGIN) U8.8(VBUS) U9.2(VIN) U10.4(IN) U11.1(EN) U11.4(IN) U13.2(VIN) U13.8(EN) U14.1(VIN) U14.3(ON/OFF) USB1.A4(VBUS) USB1.A9(VBUS) USB1.B4(VBUS) USB1.B9(VBUS)  [also labelled VDD_USB_5V]
VDD_AV_3.3V: C46.1 C53.2 C73.2 C74.2 L5.2 R23.2 R24.2 R25.2 R37.2 R42.1 R43.1 U3.G9(V33_TV) U3.K6(VCC_RTC) U3.N3(VCC_PLL) U3.V3(AVCC)
VDD_SYS_3.3V: C25.2 C26.2 C27.2 C28.2 C69.2 C72#2.2 L3.2 L5.1 R44.2 R53.2 R56.1 U3.G7(EPHY_VCC) U3.G10(VDD_EFUSE) U3.G11(VCC_USB) U3.G13(VCC_IO) U3.G14(VCC_IO) U3.G15(VCC_IO) U3.H7(VCC_PG) U3.H13(VCC_IO) U3.H14(VCC_IO) U3.J6(HVCC) U3.J14(VCC_IO) U3.J15(VCC_PD) U12.4(IN)
AP-RESET: C33.2 K1.2 R23.1 U3.V6(RESET)  [also labelled AP-RESET#]
CAM_D0: J1.19 U3.C9(PE4/CSI_D0/TS_D0)  [also labelled DVP_D0]
CAM_D1: J1.21 U3.E10(PE5/CSI_D1/TS_D1)  [also labelled DVP_D1]
CAM_D2: J1.22 U3.D10(PE6/CSI_D2/TS_D2)  [also labelled DVP_D2]
CAM_D3: J1.20 U3.C8(PE7/CSI_D3/TS_D3)  [also labelled DVP_D3]
CAM_D4: J1.18 U3.C11(PE8/CSI_D4/TS_D4)  [also labelled DVP_D4]
CAM_D5: J1.16 U3.C12(PE9/CSI_D5/TS_D5)  [also labelled DVP_D5]
CAM_D6: J1.14 U3.E8(PE10/CSI_D6/TS_D6)  [also labelled DVP_D6]
CAM_D7: J1.12 U3.A11(PE11/CSI_D7/TS_D7)  [also labelled DVP_D7]
CAM_HSYNC: R39#2.1 U3.B11(PE2/CSI_HSYNC/TS_SYNC)
CAM_MCLK: R38#2.1 U3.A10(PE1/CSI_MCLK/TS_ERR)
CAM_PCLK: R36.1 U3.B10(PE0/CSI_PCLK/TS_CLK)
CAM_VSYNC: R35#2.1 U3.C10(PE3/CSI_VSYNC/TS_DVLD)
CP_Rx: CRX1.1 U3.F5(PA4/UART0_TX/PA_EINT4) U8.25(RXD)  [also labelled UART0_TX]
CP_Tx: CTX1.1 R32.1 U3.H6(PA5/UART0_RX/PWM0/PA_EINT5)  [also labelled UART0_RX]
DVP_HSYNC: J1.9 R39#2.2
DVP_PCLK: J1.17 R36.2
DVP_PWDN: J1.8 U3.C5(PE15)  [also labelled GPIOE15]
DVP_RST: J1.6 U3.C6(PE14)  [also labelled GPIOE14]
DVP_SCL: J1.5 R10.1 U3.B12(PE12/CSI_SCK/TWI2_SCK)  [also labelled I2C2_SCL]
DVP_SDA: J1.3 R11.1 U3.C7(PE13/CSI_SDA/TWI2_SDA)  [also labelled I2C2_SDA]
DVP_VSYNC: J1.7 R35#2.2
DVP_XCLK: J1.13 R13.2 R38#2.2
DVP_XIN: 2.1(IN_A1) 2.4(OUT_Y2#) C21.2 R19.1 Y1.1(XIN)
DVP_XOUT: 2.3(IN_A2) C20.1 R19.2 Y1.3(XOUT)
EPHY-LINK-LED: C67.2 J2#2.11 U3.A2(EPHY_LINK_LED)
EPHY-RX_N: J2#2.6 U3.A4(EPHY_RXN)
EPHY-RX_P: J2#2.3 U3.B4(EPHY_RXP)
EPHY-SPD-LED: C68.2 J2#2.9 U3.F7(EPHY_SPD_LED)
EPHY-TX_N: J2#2.2 U3.A3(EPHY_TXN)
EPHY-TX_P: J2#2.1 U3.B3(EPHY_TXP)
GPIOA10/STATUS-LED: R20.1 U3.E11(PA10/SIM_DET/PA_EINT10)  [also labelled STATUS_LED]
GPIOG11: R22.1 U3.D2(PG11/PCM1_CLK/PG_EINT11)  [also labelled USR_LED]
GPIOG12/USB0-OTGID: U3.D1(PG12/PCM1_DOUT/PG_EINT12) USB1.A5(CC1) USB1.B5(CC2)  [also labelled USB0-OTGID]
GPIOL4/RECOVERY: K3.2 R25.1 U3.N2(PL4/S_JTAG_MS/S_PL_EINT4)
GPIOL8/PWR-STB: R53.1 U3.T2(PL8/S_PL_EINT8) U9.8(EN) U12.1(EN)
GPIOL9/PWR-DRAM: R44.1 U3.M6(PL9/S_PL_EINT9) U10.1(EN)
GPIOL10/PWR-LED: R21.1 U3.V2(PL10/S_PWM/S_PL_EINT10)  [also labelled PWR_STAT]
HCEC: ESD4.1(ANODE) HDMI1.13(CEC) U3.G5(HCEC)
HHPD: R3.1 R4.2 U3.M2(HHPD)
HSCL: ESD3.1(ANODE) HDMI1.15(SCL) R58.2 U3.H3(HSCL)
HSDA: ESD2.1(ANODE) HDMI1.16(SDA) R59.2 U3.K3(HSDA)
HTX0_N: HDMI1.9(D0N) U2.2(IN2) U2.9(OUT2) U3.F1(HTX0N)  [also labelled HTX0N]
HTX0_P: HDMI1.7(D0P) U2.1(IN1) U2.10(OUT1) U3.G1(HTX0P)  [also labelled HTX0P]
HTX1_N: HDMI1.6(D1N) U1.5(IN4) U1.6(OUT4) U3.G2(HTX1N)  [also labelled HTX1N]
HTX1_P: HDMI1.4(D1P) U1.4(IN3) U1.7(OUT3) U3.H2(HTX1P)  [also labelled HTX1P]
HTX2_N: HDMI1.3(D2N) U1.2(IN2) U1.9(OUT2) U3.J2(HTX2N)  [also labelled HTX2N]
HTX2_P: HDMI1.1(D2P) U1.1(IN1) U1.10(OUT1) U3.J1(HTX2P)  [also labelled HTX2P]
HTXC_N: HDMI1.12(CLKN) U2.5(IN4) U2.6(OUT4) U3.E2(HTXCN)  [also labelled HTXCN]
HTXC_P: HDMI1.10(CLKP) U2.4(IN3) U2.7(OUT3) U3.F2(HTXCP)  [also labelled HTXCP]
I2C0_SCL: 3.10(SCL) R29.1 U3.F11(PA11/TWI0_SCK/DI_TX/PA_EINT11)  [also labelled OLED_SCL]
I2C0_SDA: 3.11(SDA) R28.1 U3.C13(PA12/TWI0_SDA/DI_RX/PA_EINT12)  [also labelled OLED_SDA]
I2C1_SCL: *4.1 U3.B13(PA18/PCM0_SYNC/TWI1_SCK/PA_EINT18)
I2C1_SDA: *5.1 U3.B14(PA19/PCM0_CLK/TWI1_SDA/PA_EINT19)
IR-RX: R37.1 U3.U2(PL11/S_CIR_RX/S_PL_EINT11)
KEYADC: R42.2 U3.AA5(KEYADC)
LINEINL: U3.V1(LINEINL)
LINEINR: U3.W1(LINEINR)
LINEOUTL: C2.2 R7.2 U3.AA3(LINEOUTL)  [also labelled OUT_SND]
LINEOUTR: U3.Y3(LINEOUTR)
MBIAS: C58.1 R45.2 U3.W3(MBIAS)
MIC1_N: C34.2 C38.2 C66.2 ESD-1.1 MIC*1.1(-) R51.2
MIC1_P: C38.1 C41.2 C63#2.2 ESD-2.2 MIC*1.2(+) R46.1
MICIN1_N: C66.1 U3.Y1(MICIN1N)
MICIN1_P: C63#2.1 U3.W2(MICIN1P)
OLED_RES: 3.9(RES#) C32.2 D4.1(A) R26.2
SA0: U3.T17(SA0) U4.N3(A0)
SA1: U3.U18(SA1) U4.P7(A1)
SA2: U3.V19(SA2) U4.P3(A2)
SA3: U3.V20(SA3) U4.N2(A3)
SA4: U3.V21(SA4) U4.P8(A4)
SA5: U3.Y19(SA5) U4.P2(A5)
SA6: U3.Y20(SA6) U4.R8(A6)
SA7: U3.V15(SA7) U4.R2(A7)
SA8: U3.W18(SA8) U4.T8(A8)
SA9: U3.Y18(SA9) U4.R3(A9)
SA10: U3.P19(SA10) U4.L7(A10/AP)
SA11: U3.N19(SA11) U4.R7(A11)
SA12: U3.R18(SA12) U4.N7(A12/#BC)
SA13: U3.V12(SA13) U4.T3(A13)
SA14: U3.N17(SA14) U4.T7(NC/A14)
SA15: U3.R17(SA15) U4.M7(NC)
SBA0: U3.W17(SBA0) U4.M2(BA0)
SBA1: U3.T18(SBA1) U4.N8(BA1)
SBA2: U3.V17(SBA2) U4.M3(BA2)
SCAS: U3.U15(SCAS) U4.K3(#CAS)
SCK_N: R16.1 U3.AA20(SCKB) U4.K7(#CK)
SCK_P: R16.2 U3.AA19(SCK) U4.J7(CK)
SCKE0: U3.AA21(SCKE0) U4.K9(CKE)
SCKE1: U3.Y21(SCKE1) U4.J9(NC)
SCS0: U3.W20(SCS0) U4.L2(#CS)
SCS1: U3.W21(SCS1) U4.L1(NC)
SDC0-CLK: TF1.5(CLK) U3.D20(PF2/SDC0_CLK/UART0_TX)  [also labelled SDMMC_CLK]
SDC0-CMD: R12.2 TF1.3(CMD) U3.F18(PF3/SDC0_CMD/JTAG_DO0)  [also labelled SDMMC_CMD]
SDC0-D0: TF1.7(DATA0) U3.A19(PF1/SDC0_D0/JTAG_DI0)  [also labelled SDMMC_D0]
SDC0-D1: TF1.8(DATA1) U3.D19(PF0/SDC0_D1/JTAG_MS0)  [also labelled SDMMC_D1]
SDC0-D2: TF1.1(DATA2) U3.C20(PF5/SDC0_D2/JTAG_CK0)  [also labelled SDMMC_D2]
SDC0-D3: TF1.2(CD/DATA3) U3.E21(PF4/SDC0_D3/UART0_RX)  [also labelled SDMMC_D3]
SDC0-DET: R14.2 TF1.9(SW) U3.G18(PF6/SDC0_DET)  [also labelled SDMMC_DET]
SDQ0: U3.N20(SDQ0) U4.F8(DQL3)
SDQ1: U3.P21(SDQ1) U4.F2(DQL2)
SDQ2: U3.P20(SDQ2) U4.F7(DQL1)
SDQ3: U3.U21(SDQ3) U4.G2(DQL6)
SDQ4: U3.R19(SDQ4) U4.E3(DQL0)
SDQ5: U3.T20(SDQ5) U4.H7(DQL7)
SDQ6: U3.U19(SDQ6) U4.H8(DQL5)
SDQ7: U3.U20(SDQ7) U4.H3(DQL4)
SDQ8: U3.J19(SDQ8) U4.A7(DQU4)
SDQ9: U3.H20(SDQ9) U4.A3(DQU7)
SDQ10: U3.H21(SDQ10) U4.C8(DQU2)
SDQ11: U3.J21(SDQ11) U4.C2(DQU3)
SDQ12: U3.L20(SDQ12) U4.A2(DQU5)
SDQ13: U3.L21(SDQ13) U4.D7(DQU0)
SDQ14: U3.M21(SDQ14) U4.C3(DQU1)
SDQ15: U3.M19(SDQ15) U4.B8(DQU6)
SDQM0: U3.M20(SDQM0) U4.E7(DML)
SDQM1: U3.G20(SDQM1) U4.D3(DMU)
SDQS0_N: U3.R21(SDQS0B) U4.G3(#DQSL)
SDQS0_P: U3.R20(SDQS0) U4.F3(DQSL)
SDQS1_N: U3.J20(SDQS1B) U4.B7(#DQSU)
SDQS1_P: U3.K20(SDQS1) U4.C7(DQSU)
SODT0: U3.W11(SODT0) U4.K1(ODT)
SODT1: U3.V11(SODT1) U4.J1(NC)
SPEAKER_N: *2.1 U5.8(VO-)
SPEAKER_P: *3.1 R6.2 U5.5(VO+)
SPI0_CLK: TFT1.3(SCL) U3.B16(PC2/NAND_CLE/SPI0_CLK)  [also labelled TFT_SCK]
SPI0_CS: TFT1.5(CSX) U3.B15(PC3/NAND_CE1/SPI0_CS)  [also labelled TFT_CS]
SPI0_MISO: TFT1.7(SDO) U3.C16(PC1/NAND_ALE/SPI0_MISO)  [also labelled TFT_SDO]
SPI0_MOSI: TFT1.6(SDI) U3.C15(PC0/NAND_WE/SPI0_MOSI)  [also labelled TFT_CDI]
SRAS: U3.V13(SRAS) U4.J3(#RAS)
SRST: U3.U16(SRST) U4.T2(#RESET)
SVREF: C14.2 C15.2 C18.1 C19.2 R15.1 R17.2 U3.T16(SVREF) U4.H1(VREFDQ) U4.M8(VREFCA)
SWE: U3.W13(SWE) U4.L3(#WE)
T_CLK: IC1.16(DCLK) TP1.1 U3.G12(PA14/SPI1_CLK/UART3_RX/PA_EINT14)  [also labelled UART3_RX]
T_CS: IC1.15(CS) TP2.1 U3.E15(PA13/SPI1_CS/UART3_TX/PA_EINT13)  [also labelled UART3_TX]
T_DIN: IC1.14(DIN) TP3.1 U3.F14(PA15/SPI1_MOSI/UART3_RTS/PA_EINT15)  [also labelled UART3_RTS]
T_IRQ: IC1.11(PENIRQ) R1.2 TP5.1 U3.C14(PA17/SPDIF_OUT(OWA_OUT)/PA_EINT17)
T_OUT: IC1.12(DOUT) TP4.1 U3.D15(PA16/SPI1_MISO/UART3_CTS/PA_EINT16)  [also labelled UART3_CTS]
TFT_D/C: TFT1.4(D/C) U3.A13(PA20/PCM0_DOUT/SIM_VPPEN/PA_EINT20)
TFT_K: R2.2 U3.F16(PC4/NAND_CE0)
TFT_REST: TFT1.2(RESET) U3.A14(PA21/PCM0_DIN/SIM_VPPPP/PA_EINT21)
TFT_X+: IC1.2(X+) TFT1.15(X-)
TFT_X-: IC1.4(X-) TFT1.17(X+)
TFT_Y+: IC1.3(Y+) TFT1.18(Y+)
TFT_Y-: IC1.5(Y-) TFT1.16(Y-)
UART1_CTS: U3.E3(PG9/UART1_CTS/PG_EINT9)
UART1_RTS: U3.C3(PG8/UART1_RTS/PG_EINT8)
UART1_RX: U3.D3(PG7/UART1_RX/PG_EINT7)
UART1_TX: U3.G4(PG6/UART1_TX/PG_EINT6)
UART2_CTS: U3.E13(PA3/UART2_CTS/JTAG_DI0/PA_EINT3)
UART2_RTS: U3.D6(PA2/UART2_RTS/JTAG_DO0/PA_EINT2)
UART2_RX: *1.1 U3.D5(PA1/UART2_RX/JTAG_CK0/PA_EINT1)
UART2_TX: *6.1 U3.D11(PA0/UART2_TX/JTAG_MS0/PA_EINT0)
UBOOT: K2.2 R24.1 U3.W6(UBOOT)
USB0_N: U3.B5(USB_DM0) USB1.B7(D-)
USB0_P: U3.A5(USB_DP0) USB1.B6(D+)
USB2_N: ESD-4.2 P1.2(D-) U3.A8(USB_DM2)
USB2_P: ESD-3.2 P1.3(D+) U3.A7(USB_DP2)
USB3_N: ESD-6.2 P2.2(D-) U3.B9(USB_DM3)
USB3_P: ESD-5.2 P2.3(D+) U3.B8(USB_DP3)
USB_CP_N: U8.5(D-) USB1.A7(D-)
USB_CP_P: U8.4(D+) USB1.A6(D+)
USB_WIFI_N: 1.3(D-) U3.B7(USB_DM1)
USB_WIFI_P: 1.2(D+) U3.B6(USB_DP1)
VDD_CPUFB: C64.2 R41#2.1 R47.2 U3.T10(VDD_CPUFB)
XIN: C40.2 U3.K2(X24MIN) Y2.1(XIN)
XOUT: C39.1 U3.K1(X24MOUT) Y2.3(XOUT)
Net1_5: 1.5(ANT) A1.1
Net2_6: 2.6(OUT_Y1#) R13.1
Net3_1: 3.1(C2P) C35.2
Net3_2: 3.2(C2N) C35.1
Net3_3: 3.3(C1P) C36.1
Net3_4: 3.4(C1N) C36.2
Net3_12: 3.12(IREF) R27.2
Net3_13: 3.13(VCOMH) C37.1
Net3_14: 3.14(VCC) C31.2
NetC2_1: C2.1 R5.1
NetC3_2: C3.2 R7.1
NetC5_2: C5.2 U5.2(BYS) U5.3(IN+)
NetC23_2: C23.2 U7.1(VOUT2)
NetC42_1: C42.1 U3.H11(VDD_EFUSEBP)
NetC47_1: C47.1 J2#2.4
NetC48_1: C48.1 J2#2.5
NetC54_1: C54.1 U3.Y4(VRA1)
NetC55_2: C55.2 R40#2.2 U3.W5(VRA2)
NetC56#2_2: C56#2.2 C57.2 U3.V4(VRP)
NetC64_1: C64.1 R47.1 R50.2 U9.7(FB)
NetC65_1: C65.1 R51.1 R52.2
NetC65_2: C65.2 R45.1 R46.2
NetC81_2: C81.2 U14.4(BYPASS)
NetD1_1: D1.1(A) R20.2
NetD2_1: D2.1(A) R21.2
NetD3_1: D3.1(A) R22.2
NetESD1_1: ESD1.1(ANODE) HDMI1.19(HOT_PLUG_DET) R3.2
NetJ2#2_8: J2#2.8 R31.2
NetJ2#2_10: J2#2.10 R34#2.2
NetJ2#2_12: J2#2.12 R33.2
NetL1_1: L1.1 U9.3(SW)
NetL2_1: L2.1 U10.3(LX)
NetL3_1: L3.1 U11.3(LX)
NetL4_1: L4.1 U12.3(LX)
NetL6_1: L6.1 U13.3(SW)
NetQ1_1: Q1.1(B) R2.1
NetQ1_3: Q1.3(C) TFT1.11(LEDK1) TFT1.12(LEDK2) TFT1.13(LEDK3) TFT1.14(LEDK4)
NetR5_2: R5.2 R6.1 U5.4(IN-)
NetR8_1: R8.1 U4.L8(ZQ)
NetR9_1: R9.1 U4.L9(NC)
NetR18_1: R18.1 U3.V10(SZQ)
NetR30_2: R30.2 U8.9(*RST)
NetR32_2: R32.2 U8.26(TXD)
NetR43_2: R43.2 U3.AA6(NMI)
NetR48#2_2: R48#2.2 R49#2.2 U10.5(FB)
NetR55_2: R55.2 U3.F6(EPHY_RTX)
NetR56_2: R56.2 R60.2 U11.5(FB)
NetR57_1: R57.1 R61.2 U12.5(FB)
NetR63_2: R63.2 R64.1 U13.7(FB)

Not connected (* = marked no-connect by the designer): 3 6(VBREF); HDMI1 14(NC); IC1 7(IN3) 8(IN4) 13(BUSY); J1 1 24; J2#2 7(2) SHELL1(SHIELD) SHELL2(SHIELD); U3 A1(JTAG-SEL0) A16(PC7/NAND_RB1) A17(PC5/NAND_RE/SDC2_CLK) AA2(MICIN2N) AA8(SDQ29) AA9(SDQS3) AA11(SDQ25) AA12(SDQM3) AA14(SDQ21) AA15(SDQS2) AA17(SDQ17) AA18(SDQM2) B1(PG13/PCM1_DIN/PG_EINT13) B2(JTAG-SEL1) B17(PC12/NAND_DQ4/SDC2_D4) B18(PC8/NAND_DQ0/SDC2_D0) B19(PC13/NAND_DQ5/SDC2_D5) C1(PG5/SDC1_D3/PG_EINT5) C2(PG4/SDC1_D2/PG_EINT4) C17(PC9/NAND_DQ1/SDC2_D1) C18(PC11/NAND_DQ3/SDC2_D3) C19(PC15/NAND_DQ7/SDC2_D7) D8(PA7/SIM_CLK/PA_EINT7) D13(PA9/SIM_RST/PA_EINT9) D17(PC10/NAND_DQ2/SDC2_D2) E14(PA6/SIM_PWREN/PWM1/PA_EINT6) E16(PC6/NAND_RB0/SDC2_CMD) F3(PG3/SDC1_D1/PG_EINT3) F10(TVOUT) F13(PA8/SIM_DATA/PA_EINT8) F17(PC14/NAND_DQ6/SDC2_D6) H4(PG2/SDC1_D0/PG_EINT2) H16(PC16/NAND_DQS/SDC2_RST) J3(PG0/SDC1_CLK/PG_EINT0) K4(NC) L2(PG1/SDC1_CMD/PG_EINT1) L5(PLLTEST) M1(PL1/S_TWI_SDA/S_PL_EINT1) M3(PG10/PCM1_SYNC/PG_EINT10) N1(PL0/S_TWI_SCK/S_PL_EINT0) P2(PL2/S_UART_TX/S_PL_EINT2) P3(X32KFOUT) R1(PL3/S_UART_RX/S_PL_EINT3) R2(PL5/S_JTAG_CK/S_PL_EINT5) T3(PL7/S_JTAG_DI/S_PL_EINT7) T4(PL6/S_JTAG_DO/S_PL_EINT6) T5(TEST) U4(X32KOUT) V5(X32KIN) W9(SDQ28) W12(SDQ24) W15(SDQ19) Y2(MICIN2P) Y7(SDQ31) Y8(SDQ30) Y9(SDQS3B) Y10(SDQ27) Y11(SDQ26) Y12(SDQ23) Y13(SDQ22) Y14(SDQ20) Y15(SDQS2B) Y16(SDQ18) Y17(SDQ16); U8 1(DCD) 2(RI) 6(VDD) 10(NC) 11(*SUSPEND) 12(SUSPEND) 13(NC) 14(NC) 15(NC) 16(NC) 17(NC) 18(NC) 19(NC) 20(NC) 21(NC) 22(NC) 23(CTS) 24(RTS) 27(DSR) 28(DTR); U9 1(PG); U13 1(PG); USB1 A2(TX1+) A3(TX1-) A8(SBU1) A10(RX2-) A11(RX2+) B2(TX2+) B3(TX2-) B8(SBU2) B10(RX1-) B11(RX1+)

## Layout directives
differential pair: EPHY-RX_N, EPHY-RX_P, EPHY-TX_N, EPHY-TX_P, HTX0_N, HTX0_P, HTX1_N, HTX1_P, HTX2_N, HTX2_P, HTXC_N, HTXC_P, MIC1_N, MIC1_P, MICIN1_N, MICIN1_P, SCK_N, SCK_P, SDQS0_N, SDQS0_P, SDQS1_N, SDQS1_P, SPEAKER_N, SPEAKER_P, USB0_N, USB0_P, USB2_N, USB2_P, USB3_N, USB3_P, USB_CP_N, USB_CP_P, USB_WIFI_N, USB_WIFI_P
net class SDQ8215: SDQ8, SDQ9, SDQ10, SDQ11, SDQ12, SDQ13, SDQ14, SDQ15, SDQM0, SDQS0_N, SDQS0_P
net class SDQ027: SDQ0, SDQ1, SDQ2, SDQ3, SDQ4, SDQ5, SDQ6, SDQ7, SDQM1, SDQS1_N, SDQS1_P
net class DDR_ADD: SA0, SA1, SA2, SA3, SA4, SA5, SA6, SA7, SA8, SA9, SA10, SA11, SA12, SA13, SA14, SA15, SBA0, SBA1, SBA2, SCAS, SCK_N, SCK_P, SCKE0, SCKE1, SCS0, SCS1, SODT0, SODT1, SRAS, SRST, SWE
net class HDMI: HTX0_N, HTX0_P, HTX1_N, HTX1_P, HTX2_N, HTX2_P, HTXC_N, HTXC_P
net class DVP: DVP_D0, DVP_D1, DVP_D2, DVP_D3, DVP_D4, DVP_D5, DVP_D6, DVP_D7, DVP_PCLK, DVP_PWDN, DVP_RST, DVP_SCL, DVP_SDA, DVP_XCLK
net class SDC: SDC0-CLK, SDC0-CMD, SDC0-D0, SDC0-D1, SDC0-D2, SDC0-D3, SDC0-DET
net class NETWORK: EPHY-RX_N, EPHY-RX_P, EPHY-TX_N, EPHY-TX_P

## Notes on the sheet
- MICRO-HDMI
- CAMERA
- (near 1) WiFi
- CORE
- OLED
- (near C33) Close to IC
- MIC
- USB-TTL
- Ethernet
- (near C69) 3.3V/2A
- 1.1V/1.3V/3A
- Vfb=0.6V
- (near L2) 1.5V/1A
- DGT 3.3V@2A
- 两个贴一个LP2992电流太弱所以放个备用
- Labels drawn without touching a wire or pin: DVP_D0, DVP_D1, DVP_D2, DVP_D3, DVP_D4, DVP_D5, DVP_D6, DVP_D7, DVP_PCLK, DVP_PWDN, DVP_RST, DVP_SCL, DVP_SDA, DVP_XCLK, EPHY-RX_N, EPHY-RX_P, EPHY-TX_N, EPHY-TX_P, SA0, SA1, SA2, SA3, SA4, SA5, SA6, SA7, SA8, SA9, SA10, SA11, SA12, SA13, SA14, SA15, SBA0, SBA1, SBA2, SCAS, SCK_N, SCK_P, SCKE0, SCKE1, SCS0, SCS1, SDQ0, SDQ1, SDQ2, SDQ3, SDQ4, SDQ5, SDQ6, SDQ7, SDQ8, SDQ9, SDQ10, SDQ11, SDQ12, SDQ13, SDQ14, SDQ15, SDQM0, SDQM1, SDQS0_N, SDQS0_P, SDQS1_N, SDQS1_P, SODT0, SODT1, SRAS, SRST, SWE
- (in symbol RJ45座) Yellow; Green

## Library data of the parts
1 = USB-WiFi-ANT
2 = NL27WZU04DF
3 = OLED-6432: 显示屏
4 = BSN20BKR: N-Channel 60 V 2.8 Ohm 310 mW 0.49 nC Surface Mount Trench MosFet - SOT-23; MF: Nexperia USA; Price: None; SnapEDA_Link: https://www.snapeda.com/parts/BSN20BKR/Nexperia%20USA%20Inc./view-part/?ref=snap; Availability: Unavailable; MP: BSN20BKR; Package: SOT-23 Nexperia; Value: *
*1-*6 CRX1 CTX1 = CS: 探针焊盘; 版权归属: 源创客; BOM名称: 探针焊盘; 学习资源: www.ooocke.com
A1 = ANT-Rainsun-AP5120
C1 = C: 无极性贴片电容; 版权归属: 源创客; BOM名称: 无极性贴片电容; 学习资源: www.ooocke.com
C2 = 电容-0603: Capacitor; Value: 0.1u
C3-C55 C56#1 C56#2 C57-C62 C63#1 C63#2 C64-C71 C72#1 C72#2 C73 C74 C76-C81 = 电容-0402: Capacitor; Value: 0.1u
C75 = 0603 1uF (105) 10% 50V: 贴片电容; ComponentLink1Description: 供应商链接; ComponentLink1URL: http://www.szlcsc.com/product/details_16531.html; Supplier: LC; SuppliersPartNumber: C15849
D1 D2 = LED_0402: LED; Type: 0402; Value: color?
D3 = LED_0402: LED; Value: color?
D4-D6 = 二极管-5B5817WS: 40V
E1 E2 = AZ1045-04F
ESD1-ESD4 = 1_1.5KE100A: 1ST PART DESCRIPTION: WILL ESD9B5V Bidirection ESD Protection
ESD-1-ESD-6 = ESD-0402: ESD
HDMI1 = HDMI19_PLUG
IC1 = XPT2046: SPI触摸芯片
J1 = OV2640: Header, 24-Pin; LatestRevisionDate: 17-Jul-2002; LatestRevisionNote: Re-released for DXP Platform.; Publisher: Altium Limited
J2#1 = Micro-HDMI: Conn Micro HDMI RCP 19 POS 0.4mm Solder RA SMD 19 Terminal 1 Port Micro HDMI Embossed T/R; MF: Molex; MP: 0467650301; Package: None; Availability: Unavailable; SnapEDA_Link: https://www.snapeda.com/parts/0467650301/Molex/view-part/?ref=snap; Price: None; Value: *
J2#2 = RJ45座: MF: Wurth; MP: 615008137421; Package: None; Price: 2.50 USD; Availability: Good; SnapEDA_Link: https://www.snapeda.com/parts/615008137421/Wurth%20Electronics%20Inc/view-part/?ref=snap; Value: *
K1-K3 = ButtonTACT_3x4x2_180: Button; type: TACT 2P
L1-L4 L6 = 电感-2520: 磁珠
L5 = Ind_0402: Inductor; Specification: ±5% 100mA; Manufacturer: *
MIC*1 = MIC
P1 P2 = USB-侧立式: USB A Skt, Upright/Flag, R/A GF, W/kinked shell stake, tray; MF: Global Connector Technology; MP: USB1025-GF-P-B; Availability: Unavailable; Price: None; SnapEDA_Link: https://www.snapeda.com/parts/USB1025-GF-P-B/Global%20Connector%20Technology/view-part/?ref=snap; Package: None; Value: *
Q1 = 8050-SMD: 高频放大-NPN型; 版权归属: 源创客; 属性: 40V 1.5A 1W 100MHZ; BOM名称: 高频放大-NPN型; 学习资源: www.ooocke.com
R1 R2 = R: 贴片电阻; 版权归属: 源创客; BOM名称: 贴片电阻; 学习资源: www.ooocke.com
R3 R4 R58 R59 R63 R64 = 0402 1KΩ (1001) 1%: 贴片电阻; ComponentLink1Description: 供应商链接; ComponentLink1URL: http://www.szlcsc.com/product/details_12256.html; Supplier: LC; SuppliersPartNumber: C11702
  R63 R64: Package: 0603R
R5 R6 R8-R33 R34#1 R34#2 R37 R38#1 R39#1 R40#1 R40#2 R41#2 R42-R47 R48#1 R48#2 R49#1 R49#2 R50-R57 R60-R62 = 电阻-0402: Resistor; Value: 22R
R7 R35#1 R35#2 R36 R38#2 R39#2 R41#1 = 电阻-0402: Resistor; Value: 22R
TF1 = TF卡座: 8脚自弹
TFT1 = TFT_2.4_ILI9341_18P: TFT2.4屏ILI9341驱动18脚FPC0.5mm接口
TP1-TP5 = TEST: 测试点; 版权归属: 源创客; BOM名称: 测试点; 学习资源: www.ooocke.com
U1 U2 = rRClamp0524P: SLP2510PP8-ESD
U4 = K4B8G1646Q-MYK0(FBGA-96_512MX16_DDR3-1600)
U6 U7 = RT9011
U8 = CP2102: USB转TTL; PART DESC: SINGLE-CHIP USB TO UART BRIDGE, QFN28, RoHS.; MFG #1: SILICON LABS; PART NUMBER: CP2102; Value: Value; RefDes: RefDes; Type: DEV
U9 = MP2143DJ: LDO
U10 U11 = RT8059: LDO
U12 = SY8089A: LDO
U14 = LP2992: LDO
USB1 = USB-Type-C-TOP
Y1 Y2 = 晶振-4Pin-无源: 2520无源; MF: ECS International; MP: ECS-3225S30-240-EN-TR; Package: SMD-6 ECS International; Price: 0.75 USD; Availability: Unavailable; Value: *
U3 = ALLWINNER-H3(FBGA-347): ?: ?